# Altium project CHEM_CONTROL_BOX.PrjPcb (part 1 of 3)
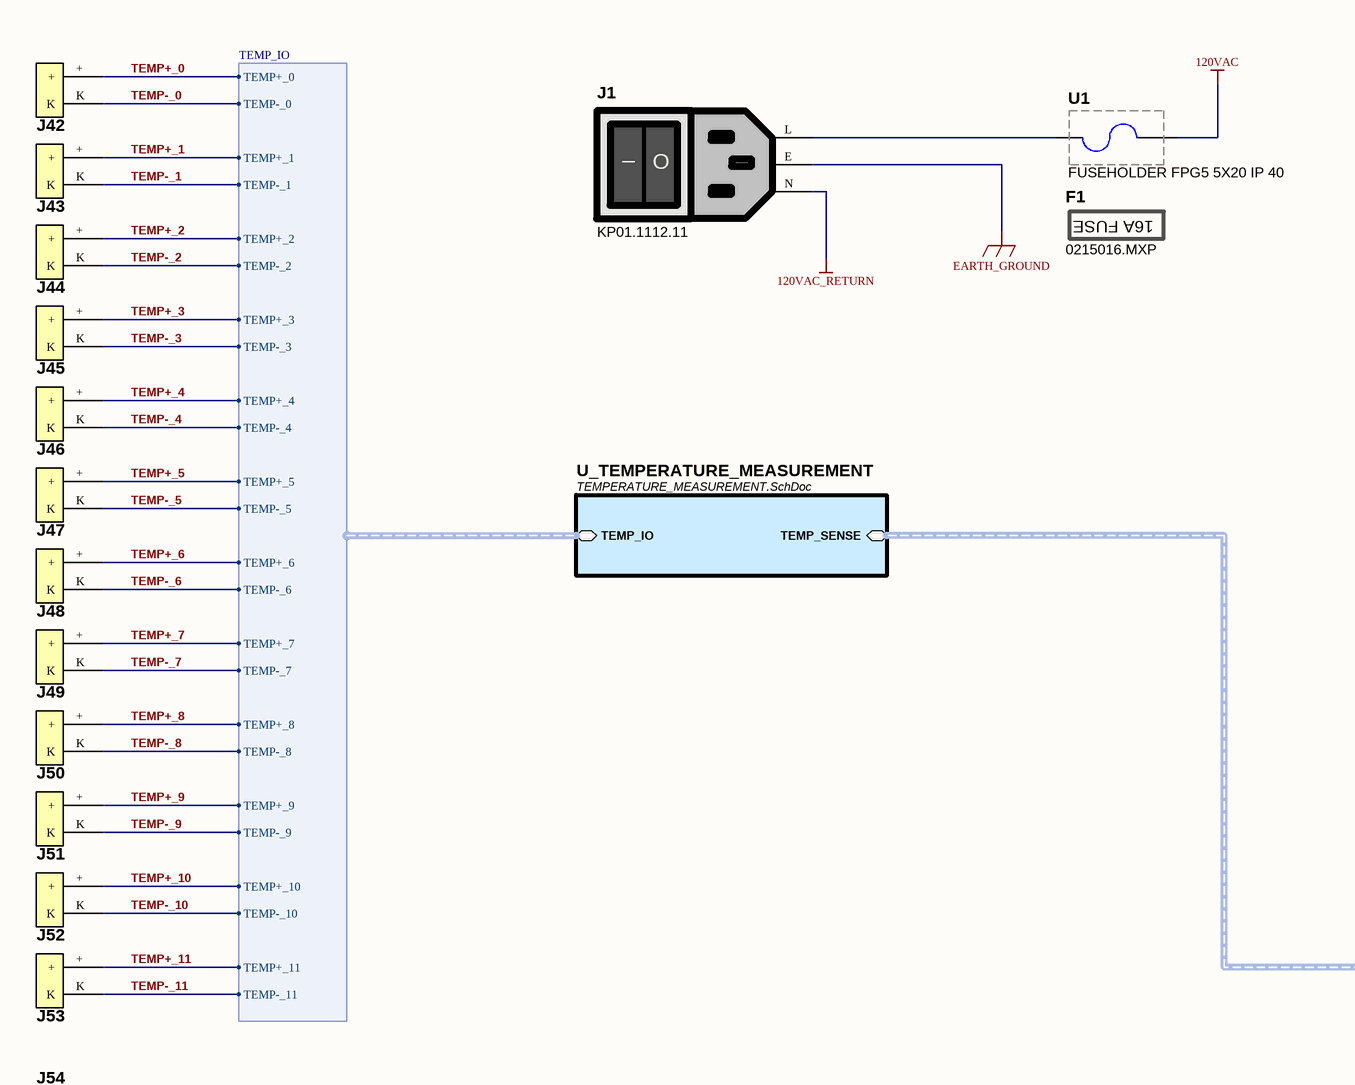
[diagram p0: CHEM_CONTROL_BOX.SchDoc, top left]
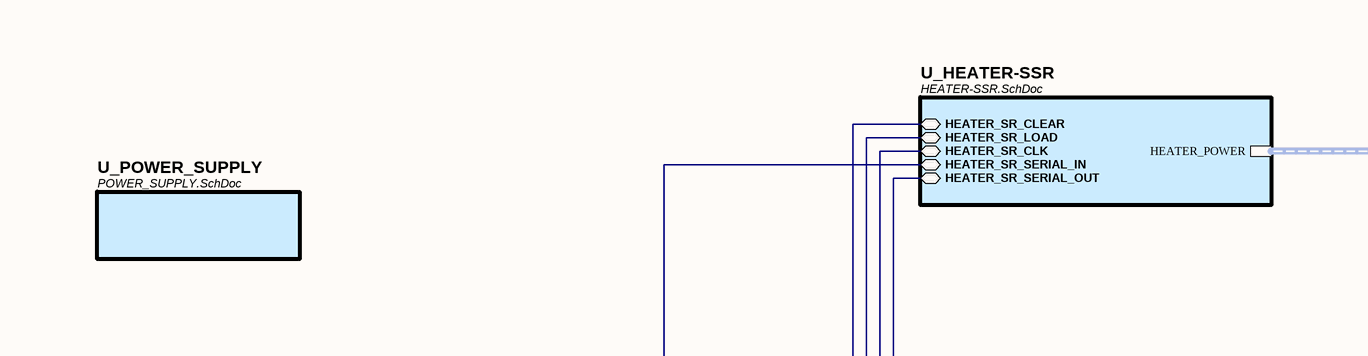
[diagram p1: CHEM_CONTROL_BOX.SchDoc, top middle]
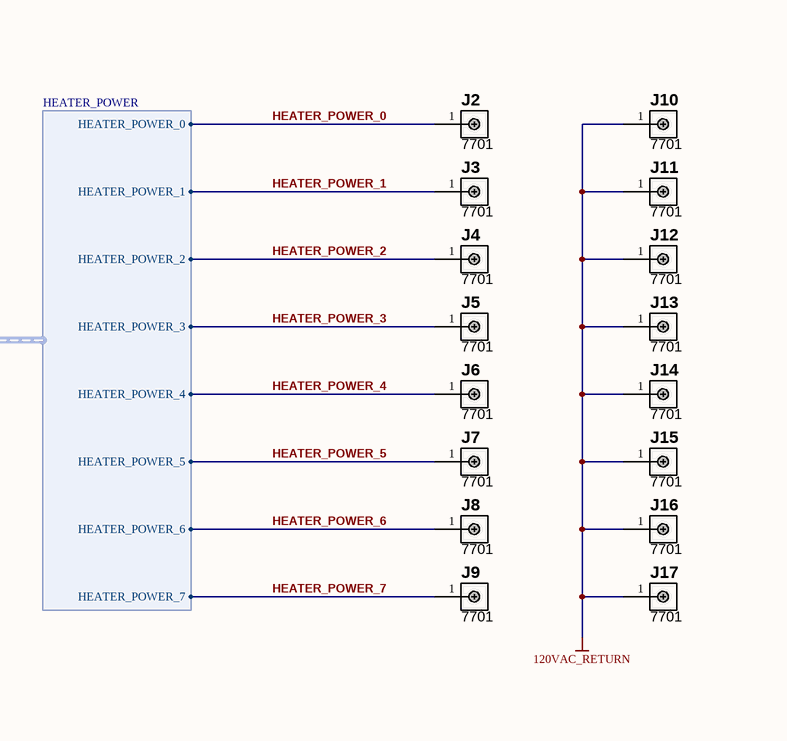
[diagram p2: CHEM_CONTROL_BOX.SchDoc, top right]
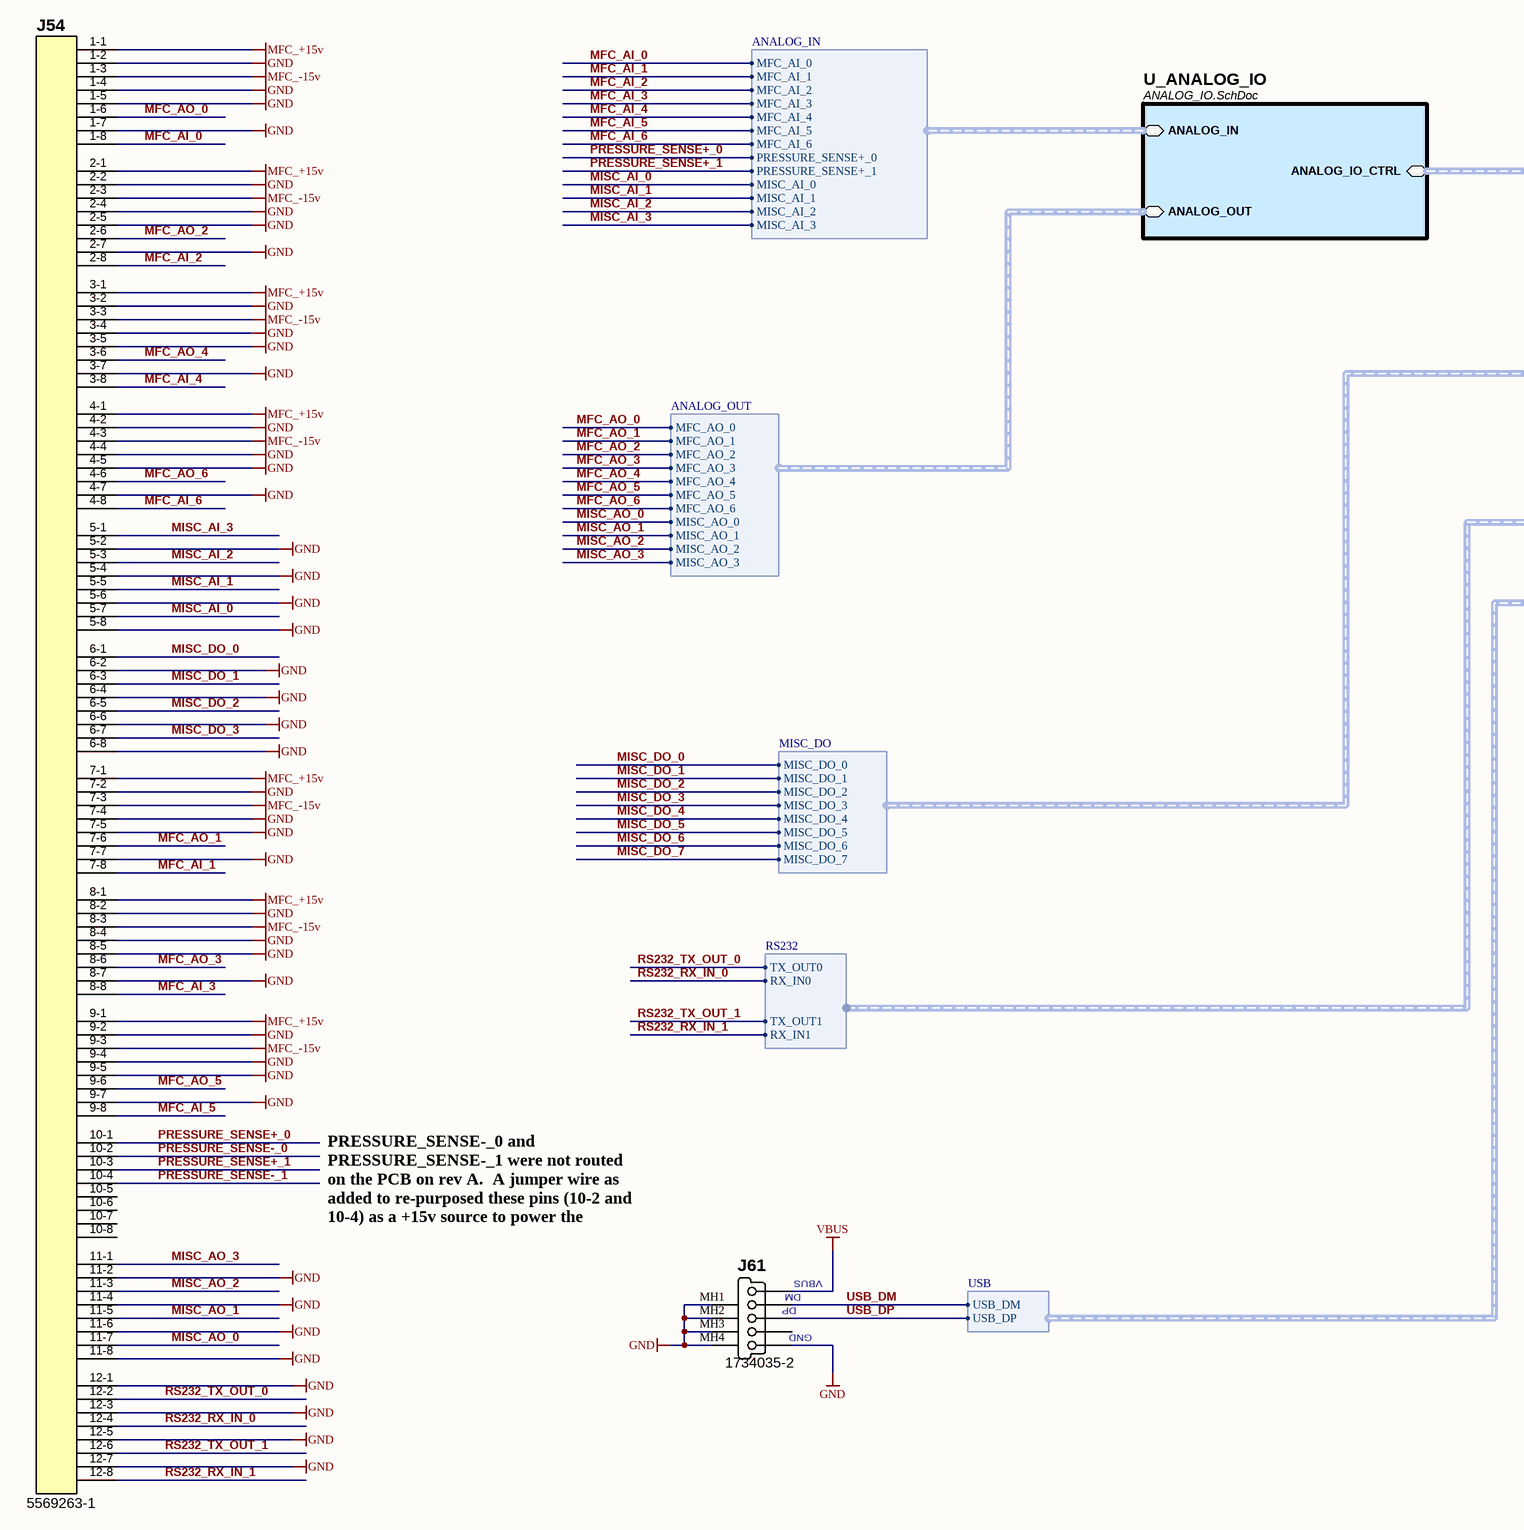
[diagram p3: CHEM_CONTROL_BOX.SchDoc, bottom left]
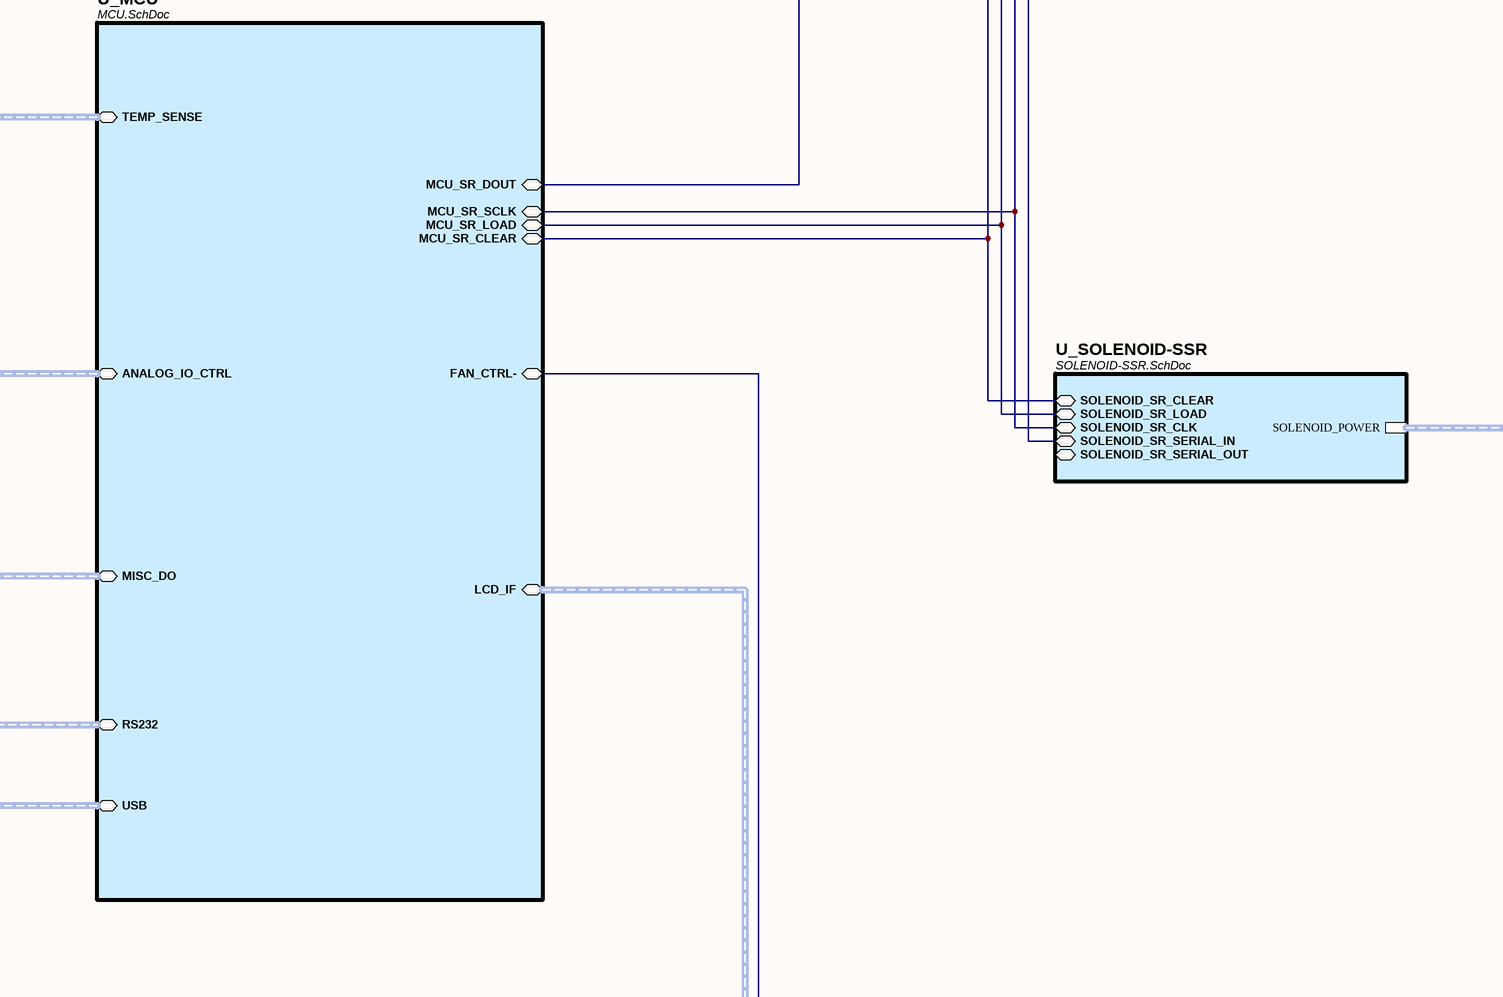
[diagram p4: CHEM_CONTROL_BOX.SchDoc, bottom middle]
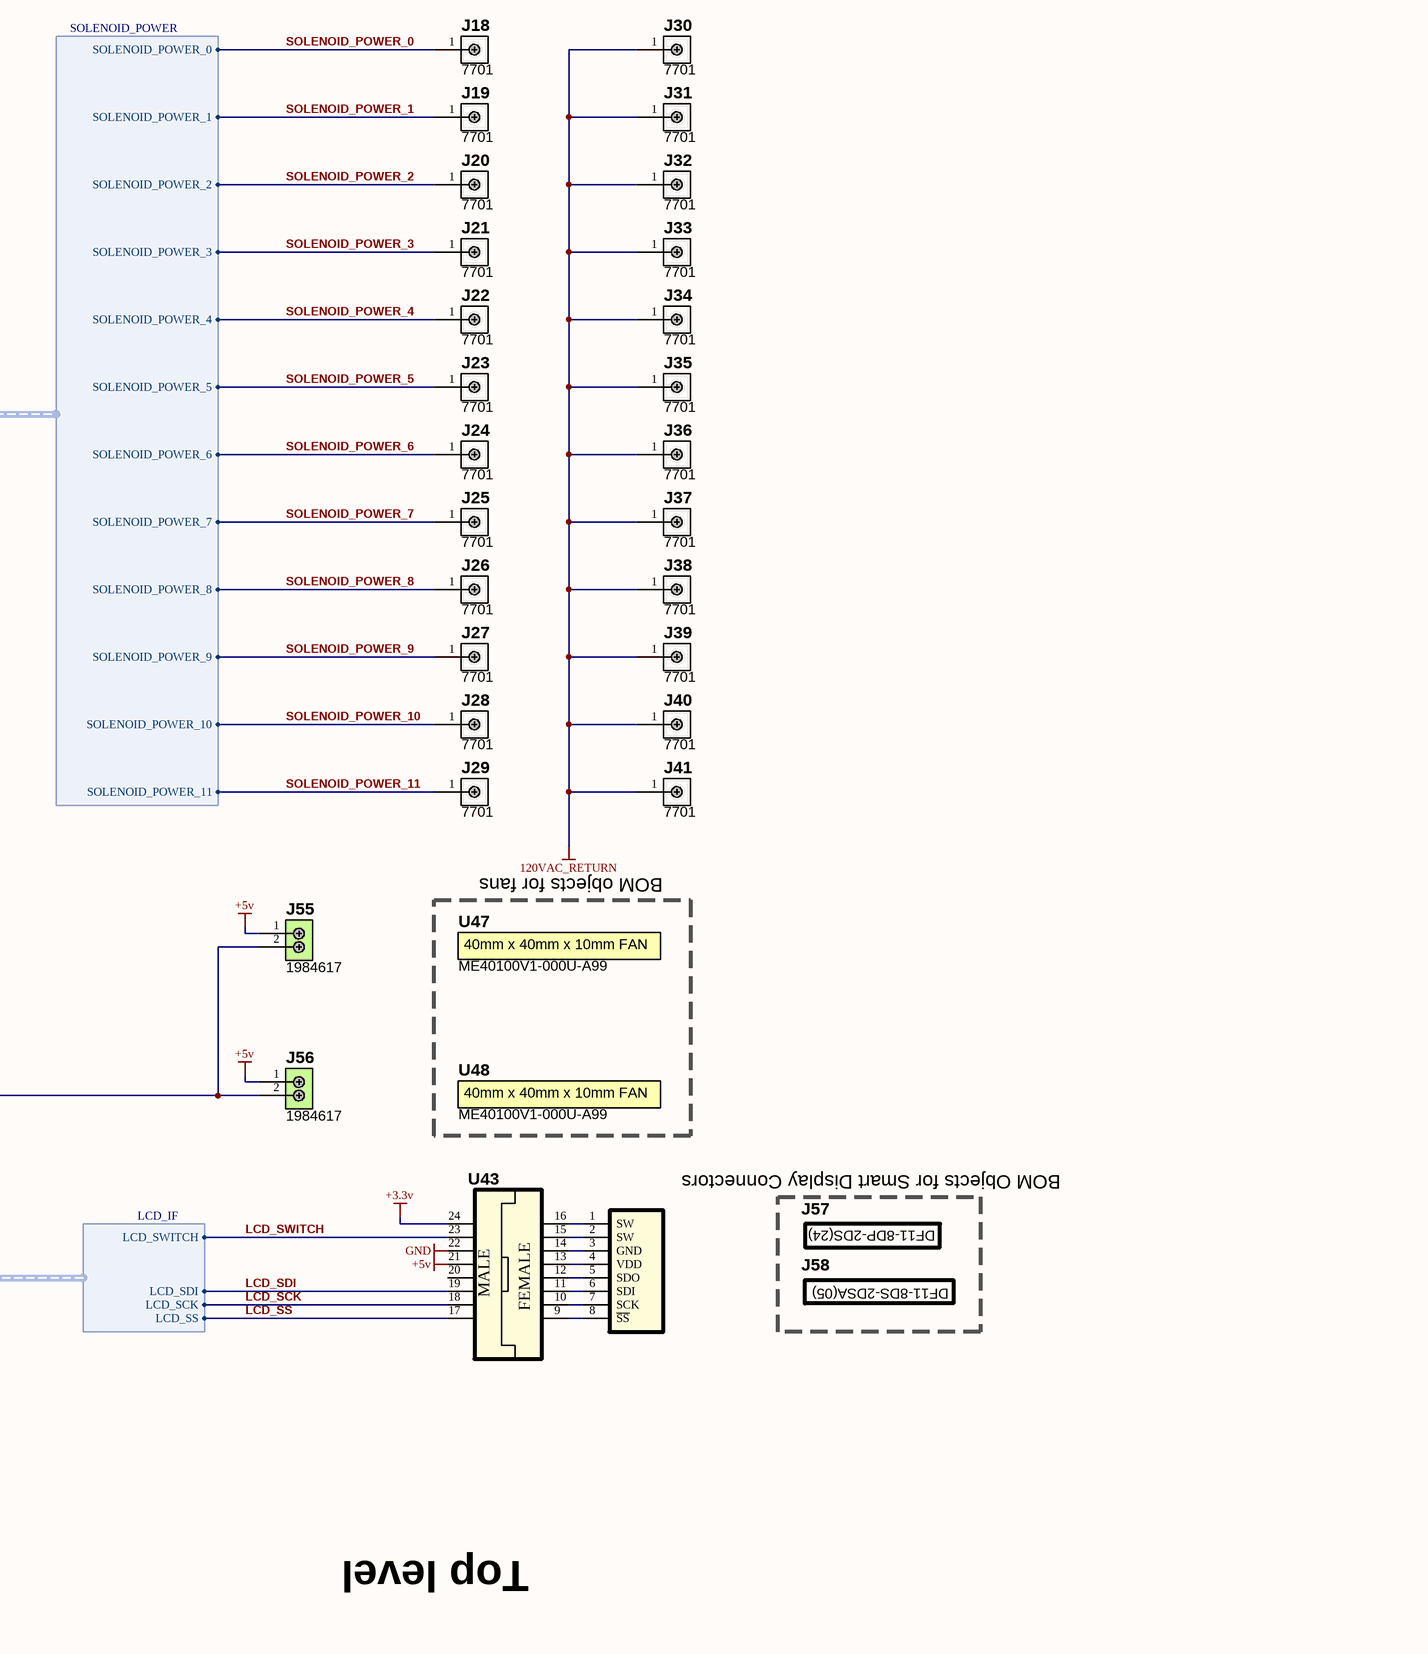
[diagram p5: CHEM_CONTROL_BOX.SchDoc, bottom right]
BOM_NOTES_LINE_1: -; BOM_NOTES_LINE_2: -; BOM_NOTES_LINE_3: -; BOM_NOTES_LINE_4: -; PCB_COPPER_WEIGHT_INNER: 2oz; PCB_COPPER_WEIGHT_OUTER: 20z; PCB_DIMENSION_X: -; PCB_DIMENSION_Y: -; PCB_DRC_DATE: 2013.09.23; PCB_FINISH_PLATING: LEAD FREE HASL; PCB_FINISHED_THICKNESS: .0625"; PCB_LAYERS: 2; PCB_MATERIAL: FR4; PCB_MIN_DRILL: 15mil; PCB_MIN_TRACE_SPACE: 8mil; PCB_MIN_TRACE_WIDTH: 8mil; PCB_PRINTOUT_SCALE: 1:1; PCB_SILKSCREEN_COLOR_BOTTOM: WHITE; PCB_SILKSCREEN_COLOR_TOP: WHITE; PCB_SOLDER_MASK_COLOR_BOTTOM: BLUE; PCB_SOLDER_MASK_COLOR_TOP: BLUE; PROJECT_ENGINEER: E.Hughes; PROJECT_PART_NUMBER_CCA: -; PROJECT_PART_NUMBER_PCB: -; PROJECT_PART_NUMBER_SCH: -; PROJECT_REVISION: a; PROJECT_SHORT_TITLE: CHEM_BOX; PROJECT_STATUS: PROTOTYPE; PROJECT_TITLE_LINE_1: Chem Control Box; SCH_DATE: 2013.9.8
7 sheets, 283 parts. Net scope: hierarchical (ports join the sheet entries above them; power ports are global).
Board file: CHEM_CONTROL_BOX.PcbDoc
Sheets:
  CHEM_CONTROL_BOX.SchDoc
    U_HEATER-SSR = HEATER-SSR.SchDoc
    U_SOLENOID-SSR = SOLENOID-SSR.SchDoc
    U_MCU = MCU.SchDoc
    U_POWER_SUPPLY = POWER_SUPPLY.SchDoc
    U_TEMPERATURE_MEASUREMENT = TEMPERATURE_MEASUREMENT.SchDoc
    U_ANALOG_IO = ANALOG_IO.SchDoc

## Sheet CHEM_CONTROL_BOX.SchDoc
size D; Organization: Altium Limited; Address1: 3 Minna Close; Address2: Belrose; Address3: NSW 2085; Address4: Australia; SheetNumber: 1; SheetTotal: 7

### Parts
F1  0215016.MXP  (mechanical)
J1  KP01.1112.11  [KP01.1112.11]
J2  7701  [7701]
J3  7701  [7701]
J4  7701  [7701]
J5  7701  [7701]
J6  7701  [7701]
J7  7701  [7701]
J8  7701  [7701]
J9  7701  [7701]
J10  7701  [7701]
J11  7701  [7701]
J12  7701  [7701]
J13  7701  [7701]
J14  7701  [7701]
J15  7701  [7701]
J16  7701  [7701]
J17  7701  [7701]
J18  7701  [7701]
J19  7701  [7701]
J20  7701  [7701]
J21  7701  [7701]
J22  7701  [7701]
J23  7701  [7701]
J24  7701  [7701]
J25  7701  [7701]
J26  7701  [7701]
J27  7701  [7701]
J28  7701  [7701]
J29  7701  [7701]
J30  7701  [7701]
J31  7701  [7701]
J32  7701  [7701]
J33  7701  [7701]
J34  7701  [7701]
J35  7701  [7701]
J36  7701  [7701]
J37  7701  [7701]
J38  7701  [7701]
J39  7701  [7701]
J40  7701  [7701]
J41  7701  [7701]
J42  PCC-SMP-K  [PCC-SMP-V]  (value not drawn)
J43  PCC-SMP-K  [PCC-SMP-V]  (value not drawn)
J44  PCC-SMP-K  [PCC-SMP-V]  (value not drawn)
J45  PCC-SMP-K  [PCC-SMP-V]  (value not drawn)
J46  PCC-SMP-K  [PCC-SMP-V]  (value not drawn)
J47  PCC-SMP-K  [PCC-SMP-V]  (value not drawn)
J48  PCC-SMP-K  [PCC-SMP-V]  (value not drawn)
J49  PCC-SMP-K  [PCC-SMP-V]  (value not drawn)
J50  PCC-SMP-K  [PCC-SMP-V]  (value not drawn)
J51  PCC-SMP-K  [PCC-SMP-V]  (value not drawn)
J52  PCC-SMP-K  [PCC-SMP-V]  (value not drawn)
J53  PCC-SMP-K  [PCC-SMP-V]  (value not drawn)
J54  5569263-1  [5569263-1]
J55  1984617  [1984617]
J56  1984617  [1984617]
J57  DF11-8DP-2DS(24)  (value not drawn)  (mechanical)
J58  DF11-8DS-2DSA(05)  (value not drawn)  (mechanical)
J61  1734035-2  [1734035-2]
U1  FUSEHOLDER FPG5 5X20 IP 40  [3101.0055]
U43  IS15DSBFP4RGB  [R/A IS15DSBFP4RGB]  (value not drawn)
U47  ME40100V1-000U-A99  [ME40100V1-000U-A99]
U48  ME40100V1-000U-A99  [ME40100V1-000U-A99]

### Sub-sheets
U_ANALOG_IO = ANALOG_IO.SchDoc: ANALOG_IN (harness ANALOG_IN), ANALOG_OUT (harness ANALOG_OUT), ANALOG_IO_CTRL (harness ANALOG_IO_CTRL)
U_HEATER-SSR = HEATER-SSR.SchDoc: HEATER_POWER (harness HEATER_POWER), HEATER_SR_CLEAR, HEATER_SR_LOAD, HEATER_SR_CLK, HEATER_SR_SERIAL_IN, HEATER_SR_SERIAL_OUT
U_MCU = MCU.SchDoc: ANALOG_IO_CTRL (harness ANALOG_IO_CTRL), TEMP_SENSE (harness TEMP_SENSE), LCD_IF (harness LCD_IF), FAN_CTRL-, MISC_DO (harness MISC_DO), RS232 (harness RS232), MCU_SR_DOUT, MCU_SR_SCLK, MCU_SR_LOAD, MCU_SR_CLEAR, USB (harness USB)
U_POWER_SUPPLY = POWER_SUPPLY.SchDoc: no entries
U_SOLENOID-SSR = SOLENOID-SSR.SchDoc: SOLENOID_POWER (harness SOLENOID_POWER), SOLENOID_SR_CLEAR, SOLENOID_SR_LOAD, SOLENOID_SR_CLK, SOLENOID_SR_SERIAL_IN, SOLENOID_SR_SERIAL_OUT
U_TEMPERATURE_MEASUREMENT = TEMPERATURE_MEASUREMENT.SchDoc: TEMP_IO (harness TEMP_IO), TEMP_SENSE (harness TEMP_SENSE)

### Harnesses
HEATER_POWER: HEATER_POWER_0, HEATER_POWER_1, HEATER_POWER_2, HEATER_POWER_3, HEATER_POWER_4, HEATER_POWER_5, HEATER_POWER_6, HEATER_POWER_7
SOLENOID_POWER: SOLENOID_POWER_0, SOLENOID_POWER_1, SOLENOID_POWER_2, SOLENOID_POWER_3, SOLENOID_POWER_4, SOLENOID_POWER_5, SOLENOID_POWER_6, SOLENOID_POWER_7, SOLENOID_POWER_8, SOLENOID_POWER_9, SOLENOID_POWER_10, SOLENOID_POWER_11
TEMP_IO: TEMP-_0, TEMP+_0, TEMP+_1, TEMP-_1, TEMP+_2, TEMP-_2, TEMP+_3, TEMP-_3, TEMP+_4, TEMP-_4, TEMP+_5, TEMP-_5, TEMP+_6, TEMP-_6, TEMP+_7, TEMP-_7, TEMP+_8, TEMP-_8, TEMP+_9, TEMP-_9, TEMP+_10, TEMP-_10, TEMP+_11, TEMP-_11
ANALOG_OUT: MFC_AO_0, MFC_AO_1, MFC_AO_2, MFC_AO_3, MFC_AO_4, MFC_AO_5, MFC_AO_6, MISC_AO_0, MISC_AO_1, MISC_AO_2, MISC_AO_3
ANALOG_IN: MFC_AI_0, MFC_AI_1, MFC_AI_2, MFC_AI_3, MFC_AI_4, MFC_AI_5, MFC_AI_6, PRESSURE_SENSE+_0, PRESSURE_SENSE+_1, MISC_AI_0, MISC_AI_1, MISC_AI_2, MISC_AI_3
LCD_IF: LCD_SWITCH, LCD_SDI, LCD_SCK, LCD_SS
MISC_DO: MISC_DO_0, MISC_DO_1, MISC_DO_2, MISC_DO_3, MISC_DO_4, MISC_DO_5, MISC_DO_6, MISC_DO_7
RS232: TX_OUT0, RX_IN0, TX_OUT1, RX_IN1
USB: USB_DM, USB_DP

### Nets
120VAC: U1.2
120VAC_RETURN: J1.N J10.1 J11.1 J12.1 J13.1 J14.1 J15.1 J16.1 J17.1 J30.1 J31.1 J32.1 J33.1 J34.1 J35.1 J36.1 J37.1 J38.1 J39.1 J40.1 J41.1
+3.3v: U43.24
+5v: J55.1 J56.1 U43.21
EARTH_GROUND: J1.E(G)
GND: J54.1-2 J54.1-4 J54.1-5 J54.1-7 J54.2-2 J54.2-4 J54.2-5 J54.2-7 J54.3-2 J54.3-4 J54.3-5 J54.3-7 J54.4-2 J54.4-4 J54.4-5 J54.4-7 J54.5-2 J54.5-4 J54.5-6 J54.5-8 J54.6-2 J54.6-4 J54.6-6 J54.6-8 J54.7-2 J54.7-4 J54.7-5 J54.7-7 J54.8-2 J54.8-4 J54.8-5 J54.8-7 J54.9-2 J54.9-4 J54.9-5 J54.9-7 J54.11-2 J54.11-4 J54.11-6 J54.11-8 J54.12-1 J54.12-3 J54.12-5 J54.12-7 J61.5(GND) J61.MH1(Tab) J61.MH2(Tab) J61.MH3(Tab) J61.MH4(Tab) U43.22
MFC_+15v: J54.1-1 J54.2-1 J54.3-1 J54.4-1 J54.7-1 J54.8-1 J54.9-1
MFC_-15v: J54.1-3 J54.2-3 J54.3-3 J54.4-3 J54.7-3 J54.8-3 J54.9-3
VBUS: J61.1(V_BUS_(5V))
HEATER_POWER_0: J2.1 ; sheet U_HEATER-SSR/HEATER_POWER.HEATER_POWER_0
HEATER_POWER_1: J3.1 ; sheet U_HEATER-SSR/HEATER_POWER.HEATER_POWER_1
HEATER_POWER_2: J4.1 ; sheet U_HEATER-SSR/HEATER_POWER.HEATER_POWER_2
HEATER_POWER_3: J5.1 ; sheet U_HEATER-SSR/HEATER_POWER.HEATER_POWER_3
HEATER_POWER_4: J6.1 ; sheet U_HEATER-SSR/HEATER_POWER.HEATER_POWER_4
HEATER_POWER_5: J7.1 ; sheet U_HEATER-SSR/HEATER_POWER.HEATER_POWER_5
HEATER_POWER_6: J8.1 ; sheet U_HEATER-SSR/HEATER_POWER.HEATER_POWER_6
HEATER_POWER_7: J9.1 ; sheet U_HEATER-SSR/HEATER_POWER.HEATER_POWER_7
LCD_SCK: U43.18 ; sheet U_HEATER-SSR/HEATER_SR_CLK, sheet U_SOLENOID-SSR/SOLENOID_SR_CLK, sheet U_MCU/MCU_SR_SCLK, sheet U_MCU/LCD_IF.LCD_SCK
LCD_SDI: U43.19 ; sheet U_MCU/LCD_IF.LCD_SDI
LCD_SS: U43.17 ; sheet U_MCU/LCD_IF.LCD_SS
LCD_SWITCH: U43.23 ; sheet U_MCU/LCD_IF.LCD_SWITCH
MCU_SR_CLEAR: sheet U_HEATER-SSR/HEATER_SR_CLEAR, sheet U_SOLENOID-SSR/SOLENOID_SR_CLEAR, sheet U_MCU/MCU_SR_CLEAR
MCU_SR_DOUT: sheet U_HEATER-SSR/HEATER_SR_SERIAL_IN, sheet U_MCU/MCU_SR_DOUT
MCU_SR_LOAD: sheet U_HEATER-SSR/HEATER_SR_LOAD, sheet U_SOLENOID-SSR/SOLENOID_SR_LOAD, sheet U_MCU/MCU_SR_LOAD
MFC_AI_0: J54.1-8 ; sheet U_ANALOG_IO/ANALOG_IN.MFC_AI_0
MFC_AI_1: J54.7-8 ; sheet U_ANALOG_IO/ANALOG_IN.MFC_AI_1
MFC_AI_2: J54.2-8 ; sheet U_ANALOG_IO/ANALOG_IN.MFC_AI_2
MFC_AI_3: J54.8-8 ; sheet U_ANALOG_IO/ANALOG_IN.MFC_AI_3
MFC_AI_4: J54.3-8 ; sheet U_ANALOG_IO/ANALOG_IN.MFC_AI_4
MFC_AI_5: J54.9-8 ; sheet U_ANALOG_IO/ANALOG_IN.MFC_AI_5
MFC_AI_6: J54.4-8 ; sheet U_ANALOG_IO/ANALOG_IN.MFC_AI_6
MFC_AO_0: J54.1-6 ; sheet U_ANALOG_IO/ANALOG_OUT.MFC_AO_0
MFC_AO_1: J54.7-6 ; sheet U_ANALOG_IO/ANALOG_OUT.MFC_AO_1
MFC_AO_2: J54.2-6 ; sheet U_ANALOG_IO/ANALOG_OUT.MFC_AO_2
MFC_AO_3: J54.8-6 ; sheet U_ANALOG_IO/ANALOG_OUT.MFC_AO_3
MFC_AO_4: J54.3-6 ; sheet U_ANALOG_IO/ANALOG_OUT.MFC_AO_4
MFC_AO_5: J54.9-6 ; sheet U_ANALOG_IO/ANALOG_OUT.MFC_AO_5
MFC_AO_6: J54.4-6 ; sheet U_ANALOG_IO/ANALOG_OUT.MFC_AO_6
MISC_AI_0: J54.5-7 ; sheet U_ANALOG_IO/ANALOG_IN.MISC_AI_0
MISC_AI_1: J54.5-5 ; sheet U_ANALOG_IO/ANALOG_IN.MISC_AI_1
MISC_AI_2: J54.5-3 ; sheet U_ANALOG_IO/ANALOG_IN.MISC_AI_2
MISC_AI_3: J54.5-1 ; sheet U_ANALOG_IO/ANALOG_IN.MISC_AI_3
MISC_AO_0: J54.11-7 ; sheet U_ANALOG_IO/ANALOG_OUT.MISC_AO_0
MISC_AO_1: J54.11-5 ; sheet U_ANALOG_IO/ANALOG_OUT.MISC_AO_1
MISC_AO_2: J54.11-3 ; sheet U_ANALOG_IO/ANALOG_OUT.MISC_AO_2
MISC_AO_3: J54.11-1 ; sheet U_ANALOG_IO/ANALOG_OUT.MISC_AO_3
MISC_DO_0: J54.6-1 ; sheet U_MCU/MISC_DO.MISC_DO_0
MISC_DO_1: J54.6-3 ; sheet U_MCU/MISC_DO.MISC_DO_1
MISC_DO_2: J54.6-5 ; sheet U_MCU/MISC_DO.MISC_DO_2
MISC_DO_3: J54.6-7 ; sheet U_MCU/MISC_DO.MISC_DO_3
PRESSURE_SENSE+_0: J54.10-1 ; sheet U_ANALOG_IO/ANALOG_IN.PRESSURE_SENSE+_0
PRESSURE_SENSE+_1: J54.10-3 ; sheet U_ANALOG_IO/ANALOG_IN.PRESSURE_SENSE+_1
PRESSURE_SENSE-_0: J54.10-2
PRESSURE_SENSE-_1: J54.10-4
RS232_RX_IN_0: J54.12-4 ; sheet U_MCU/RS232.RX_IN0
RS232_RX_IN_1: J54.12-8 ; sheet U_MCU/RS232.RX_IN1
RS232_TX_OUT_0: J54.12-2 ; sheet U_MCU/RS232.TX_OUT0
RS232_TX_OUT_1: J54.12-6 ; sheet U_MCU/RS232.TX_OUT1
SOLENOID_POWER_0: J18.1 ; sheet U_SOLENOID-SSR/SOLENOID_POWER.SOLENOID_POWER_0
SOLENOID_POWER_1: J19.1 ; sheet U_SOLENOID-SSR/SOLENOID_POWER.SOLENOID_POWER_1
SOLENOID_POWER_2: J20.1 ; sheet U_SOLENOID-SSR/SOLENOID_POWER.SOLENOID_POWER_2
SOLENOID_POWER_3: J21.1 ; sheet U_SOLENOID-SSR/SOLENOID_POWER.SOLENOID_POWER_3
SOLENOID_POWER_4: J22.1 ; sheet U_SOLENOID-SSR/SOLENOID_POWER.SOLENOID_POWER_4
SOLENOID_POWER_5: J23.1 ; sheet U_SOLENOID-SSR/SOLENOID_POWER.SOLENOID_POWER_5
SOLENOID_POWER_6: J24.1 ; sheet U_SOLENOID-SSR/SOLENOID_POWER.SOLENOID_POWER_6
SOLENOID_POWER_7: J25.1 ; sheet U_SOLENOID-SSR/SOLENOID_POWER.SOLENOID_POWER_7
SOLENOID_POWER_8: J26.1 ; sheet U_SOLENOID-SSR/SOLENOID_POWER.SOLENOID_POWER_8
SOLENOID_POWER_9: J27.1 ; sheet U_SOLENOID-SSR/SOLENOID_POWER.SOLENOID_POWER_9
SOLENOID_POWER_10: J28.1 ; sheet U_SOLENOID-SSR/SOLENOID_POWER.SOLENOID_POWER_10
SOLENOID_POWER_11: J29.1 ; sheet U_SOLENOID-SSR/SOLENOID_POWER.SOLENOID_POWER_11
TEMP+_0: J42.+ ; sheet U_TEMPERATURE_MEASUREMENT/TEMP_IO.TEMP+_0
TEMP+_1: J43.+ ; sheet U_TEMPERATURE_MEASUREMENT/TEMP_IO.TEMP+_1
TEMP+_2: J44.+ ; sheet U_TEMPERATURE_MEASUREMENT/TEMP_IO.TEMP+_2
TEMP+_3: J45.+ ; sheet U_TEMPERATURE_MEASUREMENT/TEMP_IO.TEMP+_3
TEMP+_4: J46.+ ; sheet U_TEMPERATURE_MEASUREMENT/TEMP_IO.TEMP+_4
TEMP+_5: J47.+ ; sheet U_TEMPERATURE_MEASUREMENT/TEMP_IO.TEMP+_5
TEMP+_6: J48.+ ; sheet U_TEMPERATURE_MEASUREMENT/TEMP_IO.TEMP+_6
TEMP+_7: J49.+ ; sheet U_TEMPERATURE_MEASUREMENT/TEMP_IO.TEMP+_7
TEMP+_8: J50.+ ; sheet U_TEMPERATURE_MEASUREMENT/TEMP_IO.TEMP+_8
TEMP+_9: J51.+ ; sheet U_TEMPERATURE_MEASUREMENT/TEMP_IO.TEMP+_9
TEMP+_10: J52.+ ; sheet U_TEMPERATURE_MEASUREMENT/TEMP_IO.TEMP+_10
TEMP+_11: J53.+ ; sheet U_TEMPERATURE_MEASUREMENT/TEMP_IO.TEMP+_11
TEMP-_0: J42.K ; sheet U_TEMPERATURE_MEASUREMENT/TEMP_IO.TEMP-_0
TEMP-_1: J43.K ; sheet U_TEMPERATURE_MEASUREMENT/TEMP_IO.TEMP-_1
TEMP-_2: J44.K ; sheet U_TEMPERATURE_MEASUREMENT/TEMP_IO.TEMP-_2
TEMP-_3: J45.K ; sheet U_TEMPERATURE_MEASUREMENT/TEMP_IO.TEMP-_3
TEMP-_4: J46.K ; sheet U_TEMPERATURE_MEASUREMENT/TEMP_IO.TEMP-_4
TEMP-_5: J47.K ; sheet U_TEMPERATURE_MEASUREMENT/TEMP_IO.TEMP-_5
TEMP-_6: J48.K ; sheet U_TEMPERATURE_MEASUREMENT/TEMP_IO.TEMP-_6
TEMP-_7: J49.K ; sheet U_TEMPERATURE_MEASUREMENT/TEMP_IO.TEMP-_7
TEMP-_8: J50.K ; sheet U_TEMPERATURE_MEASUREMENT/TEMP_IO.TEMP-_8
TEMP-_9: J51.K ; sheet U_TEMPERATURE_MEASUREMENT/TEMP_IO.TEMP-_9
TEMP-_10: J52.K ; sheet U_TEMPERATURE_MEASUREMENT/TEMP_IO.TEMP-_10
TEMP-_11: J53.K ; sheet U_TEMPERATURE_MEASUREMENT/TEMP_IO.TEMP-_11
USB_DM: J61.2(D-) ; sheet U_MCU/USB.USB_DM
USB_DP: J61.3(D+) ; sheet U_MCU/USB.USB_DP
NetC73_1: J55.2 J56.2 ; sheet U_MCU/FAN_CTRL-
NetJ1_L: J1.L U1.1
NetU37_14: sheet U_HEATER-SSR/HEATER_SR_SERIAL_OUT, sheet U_SOLENOID-SSR/SOLENOID_SR_SERIAL_IN
NetU43_1: U43.1(SW) U43.16
NetU43_2: U43.2(SW) U43.15
NetU43_3: U43.3(GND) U43.14
NetU43_4: U43.4(VDD) U43.13
NetU43_5: U43.5(SDO) U43.12
NetU43_6: U43.6(SDI) U43.11
NetU43_7: U43.7(SCK) U43.10
NetU43_8: U43.8(~{SS}) U43.9

Not connected (* = marked no-connect by the designer): J54 10-5 10-6 10-7 10-8; J61 4(NC); U43 20

### Buses and harness runs
harness sheet U_ANALOG_IO/ANALOG_IO_CTRL = sheet U_MCU/ANALOG_IO_CTRL
harness sheet U_MCU/TEMP_SENSE = sheet U_TEMPERATURE_MEASUREMENT/TEMP_SENSE

### Notes on the sheet
- BOM objects for fans
- BOM Objects for Smart Display Connectors
- PRESSURE_SENSE-_0 and PRESSURE_SENSE-_1 were not routed on the PCB on rev A.  A jumper wire as added to re-purposed these pins (10-2 and 10-4) as a +15v source to power the pressure sensor
- Top level
- -1
- Wavenumber LLC
- 2pl
- Rev:
- Sheet
- of
- (in symbol 0215016.MXP) 16A FUSE
- (in symbol 1734035-2) VBUS; DM; DP
- (in symbol KP01.1112.11) _; O
- (in symbol ME40100V1-000U-A99) 40mm x 40mm x 10mm FAN
- (in symbol R/A IS15DSBFP4RGB) MALE; FEMALE

### Library data of the parts
F1 = 0215016.MXP: FUSE 16A 250VAC 5X20 SLOW; Manufacturer: Littelfuse Inc; Fuse Type: Cartridge, Ceramic; Voltage Rating - AC: 250V; Breaking Capacity @ Rated Voltage: 500A; Melting I²t: 1408; Approvals: PSE, SEMKO, UL; DC Cold Resistance: 0.0031 Ohm; Value: 0215016.MXP; Supplier 1: Digi-Key; Supplier Part Number 1: F6044-ND; Manufacturer Part Number: 0215016.MXP; RoHS: RoHS Compliant; Category: Circuit Protection; Stock 1: 800; Pricing 1: 1=1.61, 10=1.456, 25=1.3796, 50=1.1754, 100=0.9965, 250=0.97092, 500=0.8176, 1000=0.72818, 2500=0.68985 (USD); Packaging: Bulk; Current Rating: 16A; Voltage Rating - DC: -; Response Time: Slow; Package / Case: 5mm x 20mm; Mounting Type: Holder; Operating Temperature: -55°C ~ 125°C; Color: -; Size / Dimension: 0.205" Dia x 0.787" L (5.20mm x 20.00mm); ComponentLink1URL: http://www.littelfuse.com/data/en/Data_Sheets/Littelfuse_Fuse_215_Series.pdf; ComponentLink1Description: http://www.littelfuse.com/data/en/Data_Sheets/Littelfuse_Fuse_215_Series.pdf
J1 = KP01.1112.11: AC Power Entry Modules SNAP-N PCB 2-POLE; Manufacturer: Schurter; Connector Type: IEC-320 C-14; Current Rating: 10 A; Filtered: No; Switch Function: Switched; Voltage Rating: 250 V; Value: KP01.1112.11; Supplier 1: Mouser; Supplier Part Number 1: 693-KP01.1112.11; Manufacturer Part Number: KP01.1112.11; RoHS: RoHS Compliant; Category: AC Power Entry Modules; Stock 1: 316; Pricing 1: 1=15.82, 25=14.04, 50=12.65, 100=11.93, 200=10.48 (AUD); Fused: No; Housing Material: Thermoplastic; Operating Temperature Range: - 25 C to + 70 C; Product: Inlets; Series: KP; Termination Style: Quick Connect; Flammability Rating: UL 94 V-0; Mounting Style: Snap In; Product Category: Power Entry Modules; Standard Pack Qty: 50; RoHS - Mouser: Y; Minimum Order Quantity: 1; Reeling: False; ComponentLink1URL: http://www.schurterinc.com/pdf/english/typ_kp__switch_.pdf; ComponentLink1Description: http://www.schurterinc.com/pdf/english/typ_kp__switch_.pdf
J2-J41 = 7701: TERM W/ASSEMBLD SCREW VERT PCMNT; Manufacturer: Keystone Electronics; Screw Size: 6-32; Current Rating: 15A; Number of Legs: 4; Screw Material: Brass; Screw Finish: Nickel; Supplier 1: Digi-Key; Supplier Part Number 1: 7701K-ND; Manufacturer Part Number: 7701; RoHS: RoHS Compliant; Category: Connectors, Interconnects; Stock 1: 77817; Pricing 1: 1=0.49, 10=0.462, 50=0.449, 100=0.354, 250=0.32324, 500=0.30784, 1000=0.256, 2500=0.23088, 5000=0.22318 (USD); Terminal Type: Screw Terminal, Power Tap; Termination: Solder; Mounting Type: Through Hole; Features: -; Contact Finish: Tin; Contact Material: Brass; Material - Insulation: -; ComponentLink1URL: http://www.keyelco.com/product-pdf.cfm?p=1081; ComponentLink1Description: http://www.keyelco.com/product-pdf.cfm?p=1081; Value: 7701
J42-J53 = PCC-SMP-K-100: Vertical K type thermocouple connector - K; Manufacturer: Omega; Manufacturer Part Number]: PCC-SMP-K-100; Supplier 1: Omega; Value: PCC-SMP-K; Supplier Part Number 1: PCC-SMP-K-100
J54 = 5569263-1: CONN MOD JACK R/A 8P8C SHIELDED; Manufacturer: TE Connectivity; Number of Positions/Contacts: 8p8c (RJ45, Ethernet); Number of Ports: 12; Shielding: Shielded, EMI Finger; Ratings: Cat5; LED Color: Does Not Contain LED; Tab Direction: Up and Down; Value: 5569263-1; Supplier 1: Digi-Key; Supplier Part Number 1: A31480-ND; Manufacturer Part Number: 5569263-1; RoHS: RoHS Compliant; Category: Connectors, Interconnects; Stock 1: 503; Pricing 1: 1=21.11, 10=19.055, 50=17.115, 100=16.5445, 250=15.63172, 500=15.1753, 1000=14.833 (USD); Packaging: Bulk; Connector Type: Jack; Number of Rows: 2; Mounting Type: Through Hole; Orientation: 90° Angle (Right); Termination: Solder; Features: Board Guide; Ingress Protection: -; Contact Material: Phosphor Bronze; Contact Finish: Gold; Contact Finish Thickness: 50µin (1.27µm); Housing Material: Polycyclohexylenedimethylene Terephthalate (PCT), Polyester; Operating Temperature: -40°C ~ 85°C; ComponentLink1URL: http://www.te.com/commerce/DocumentDelivery/DDEController?Action=srchrtrv&DocNm=5569263&DocType=Customer+Drawing&DocLang=English; ComponentLink1Description: http://www.te.com/commerce/DocumentDelivery/DDEController?Action=srchrtrv&DocNm=5569263&DocType=Customer+Drawing&DocLang=English
J55 J56 = 1984617: CONN TERM BLOCK T/H 2POS 3.5MM; Manufacturer: Phoenix Contact; Number of Levels: 1; Positions Per Level: 2; Pitch: 0.138" (3.50mm); Mating Orientation: Horizontal with Board; Current: 10A; Voltage: 300V; Wire Gauge: 16-26 AWG; Wire Termination: Screw - Rising Cage Clamp; Torque - Screw: 0.22-0.25 Nm (1.9-2.2 Lb-In); Screw Thread: M2; Supplier 1: Digi-Key; Supplier Part Number 1: 277-1721-ND; Manufacturer Part Number: 1984617; RoHS: RoHS Compliant; Category: Connectors, Interconnects; Stock 1: 10915; Pricing 1: 1=0.34, 10=0.322, 50=0.308, 100=0.2996, 250=0.28, 500=0.2576, 1000=0.238 (USD); Mounting Type: Through Hole; Features: Interlocking (Side); Color: Green; Packaging: Bulk; Operating Temperature: -; Housing Material: Polyamide (PA), Nylon; Contact Material - Plating: -; Clamp Material - Plating: -; Screw Material - Plating: -; ComponentLink1URL: http://media.digikey.com/pdf/Data%20Sheets/Phoenix%20Contact%20PDFs/1984617.pdf; ComponentLink1Description: http://media.digikey.com/pdf/Data%20Sheets/Phoenix%20Contact%20PDFs/1984617.pdf; Value: 1984617
J57 = DF11-8DP-2DS(24) (BOM ITEM): CONN HEADER 8POS 2MM RT ANG TIN; Manufacturer: Hirose Electric Co Ltd; Connector Type: Header, Shrouded; Number of Positions: 8; Number of Positions Loaded: All; Pitch: 0.079" (2.00mm); Supplier 1: Digi-Key; Manufacturer Part Number: DF11-8DP-2DS(24); RoHS: RoHS Compliant; Category: Connectors, Interconnects; Stock 1: 3605; Pricing 1: 1=0.87, 10=0.612, 50=0.472, 100=0.4108, 250=0.3496, 500=0.33212, 1000=0.29716, 2500=0.23598, 5000=0.23248 (USD); Packaging: Tube; Contact Type: Male Pin; Number of Rows: 2; Row Spacing: 0.079" (2.00mm); Contact Mating Length: 0.118" (3.00mm); Mounting Type: Through Hole, Right Angle; Termination: Solder; Fastening Type: Detent Lock; Features: -; Contact Finish: Tin; Contact Finish Thickness: -; Color: Black; ComponentLink1URL: http://www.hirose.co.jp/cataloge_hp/en_DF11_20130411.pdf; ComponentLink1Description: http://www.hirose.co.jp/cataloge_hp/en_DF11_20130411.pdf; Supplier Part Number 1: H10246-ND; Value: DF11-8DP-2DS(24)
J58 = DF11-8DS-2DSA(05) (BOM ITEM): CONN RECEPT 8POS 2MM PCB TIN; Manufacturer: Hirose Electric Co Ltd; Connector Type: Receptacle; Number of Positions: 8; Number of Positions Loaded: All; Pitch: 0.079" (2.00mm); Supplier 1: Digi-Key; Manufacturer Part Number: DF11-8DS-2DSA(05); RoHS: RoHS Compliant; Category: Connectors, Interconnects; Stock 1: 2569; Pricing 1: 1=1.14, 10=0.885, 25=0.8252, 50=0.75, 100=0.675, 250=0.57, 500=0.54, 1000=0.48, 2500=0.399 (USD); Packaging: Bulk; Contact Type: Female Socket; Number of Rows: 2; Row Spacing: 0.079" (2.00mm); Mounting Type: Through Hole; Termination: Press-Fit; Fastening Type: -; Features: -; Contact Finish: Tin; Contact Finish Thickness: -; Color: Black; ComponentLink1URL: http://www.hirose.co.jp/cataloge_hp/en_DF11_20130411.pdf; ComponentLink1Description: http://www.hirose.co.jp/cataloge_hp/en_DF11_20130411.pdf; Supplier Part Number 1: H10170-ND; Value: DF11-8DS-2DSA(05)
J61 = 1734035-2: Manufacturer: TE Connectivity; Connector Type: USB - mini B; Number of Contacts: 5; Gender: Receptacle; Specifications: USB 2.0; Supplier 1: Digi-Key; Supplier Part Number 1: A31727CT-ND; Manufacturer Part Number: 1734035-2; RoHS: RoHS Compliant; Category: Connectors, Interconnects; Stock 1: 133786; Pricing 1: 1=1.51, 10=1.325, 25=1.2476, 50=1.1956, 100=1.1435, 250=1.03956 (USD); Mounting Type: Surface Mount, Right Angle, Horizontal; Features: Board Guide; Packaging: Cut Tape (CT); Ingress Protection: -; ComponentLink1URL: http://documents.tycoelectronics.com/commerce/DocumentDelivery/DDEController?Action=srchrtrv&DocNm=1734035&DocType=CD&DocLang=EN; ComponentLink1Description: http://documents.tycoelectronics.com/commerce/DocumentDelivery/DDEController?Action=srchrtrv&DocNm=1734035&DocType=CD&DocLang=EN; Value: 1734035-2
U1 = 3101.0055: Manufacturer: Schurter Inc; Fuse Size: 5mm x 20mm; Number of Circuits: 1; Voltage: 250V; Current Rating: 16A; Value: FUSEHOLDER FPG5 5X20 IP 40; Supplier 1: Digi-Key; Supplier Part Number 1: 486-2056-ND; Manufacturer Part Number: 3101.0055; RoHS: RoHS Compliant; Category: Circuit Protection; Stock 1: 125; Pricing 1: 1=3.07, 25=2.454, 50=2.2086, 100=2.0859, 250=1.84052, 500=1.63192 (USD); Type: Holder; Mounting Type: PCB, Horizontal; Termination Style: PC Pin; Material: Copper Alloy, Tin Plated; ComponentLink1URL: http://www.schurterinc.com/var/schurter/storage/ilcatalogue/files/document/datasheet/en/pdf/typ_FPG5.pdf; ComponentLink1Description: http://www.schurterinc.com/var/schurter/storage/ilcatalogue/files/document/datasheet/en/pdf/typ_FPG5.pdf
U43 = R/A IS15DSBFP4RGB: 64x32 Compact Smart Switch; Manufacturer: NKK Switches; Male Connetor: DF11-8DP-2DS(24); Supplier 1: Mouser; Supplier Part Number 1: 633-IS15DSBFP4RGB; Value: IS15DSBFP4RGB; Manufacturer Part Number: IS15DSBFP4RGB
U47 U48 = ME40100V1-000U-A99: FAN 40X10MM 5VDC 1.08W 8CFM; Manufacturer: Sunon Fans; Air Flow: 8.0 CFM (0.226m&sup3;/min); Static Pressure: 0.190 in H2O (47.3 Pa); Bearing Type: Vapo-Bearing™; Fan Type: Tubeaxial; Noise: 32 dB(A); RPM: 7000 RPM; Current Rating: 0.215A; Material - Frame: Polybutylene Terephthalate (PBT); Value: ME40100V1-000U-A99; Supplier 1: Digi-Key; Supplier Part Number 1: 259-1575-ND; Manufacturer Part Number: ME40100V1-000U-A99; RoHS: RoHS Compliant; Category: Fans, Thermal Management; Stock 1: 4525; Pricing 1: 1=4.75, 10=4.356, 25=3.96, 50=3.564, 100=3.267, 250=3.11852, 500=2.9205, 1000=2.7225 (USD); Voltage - Rated: 5VDC; Features: -; Power (Watts): 1.08W; Size / Dimension: Square - 40mm L x 40mm H x 10mm W; Termination: 2 Wire Leads; Weight: 0.03 lb (13.61g); Operating Temperature: -; Voltage Range: -; Life Expectancy: -; Material - Blade: Polybutylene Terephthalate (PBT); ComponentLink1URL: http://www.sunon.com/uFiles/file/03_products/08-catalog%20download/Sunon%20DC%20Brushless%20Fan%20&%20Blower_(190-E).pdf; ComponentLink1Description: http://www.sunon.com/uFiles/file/03_products/08-catalog%20download/Sunon%20DC%20Brushless%20Fan%20&%20Blower_(190-E).pdf

## Sheet HEATER-SSR.SchDoc
size D; SheetNumber: 5; SheetTotal: 7
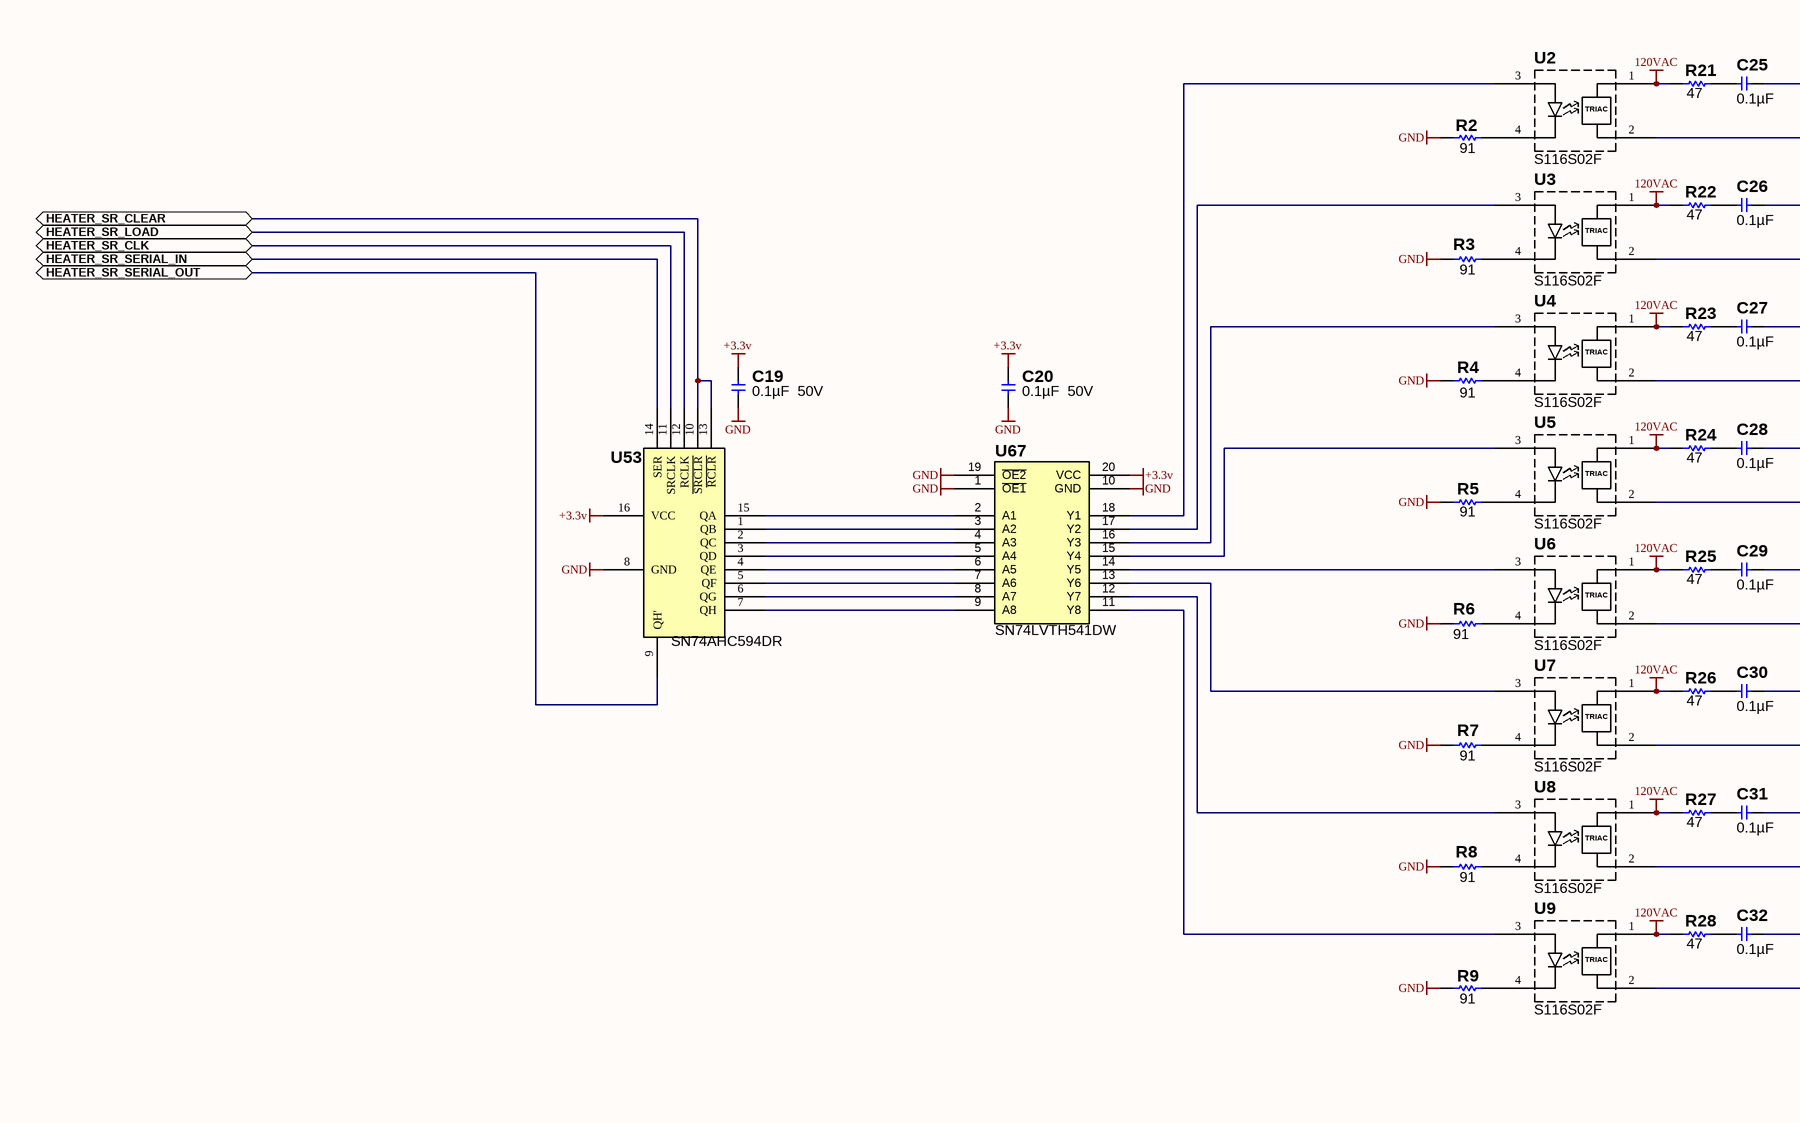
[diagram p6: HEATER-SSR.SchDoc, left]
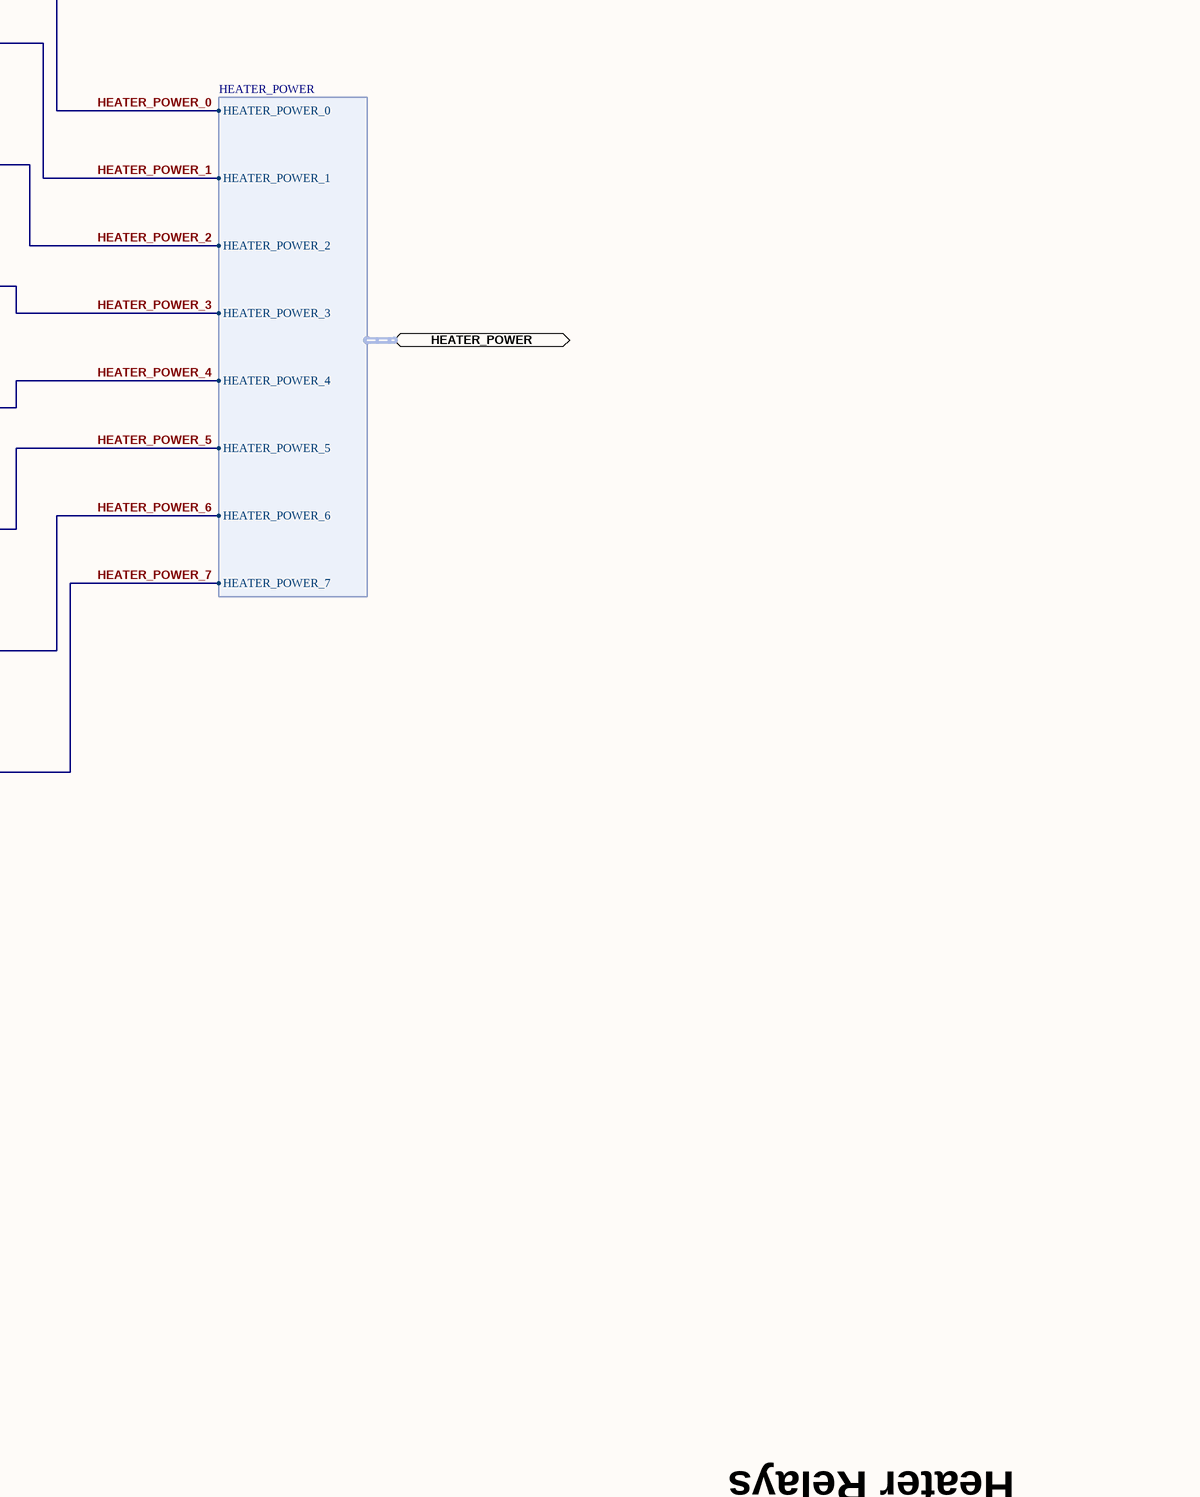
[diagram p7: HEATER-SSR.SchDoc, right]

### Parts
C19  0.1µF  50V  [C0805_LD]
C20  0.1µF  50V  [C0805_LD]
C25  0.1µF  [C1206_LD]
C26  0.1µF  [C1206_LD]
C27  0.1µF  [C1206_LD]
C28  0.1µF  [C1206_LD]
C29  0.1µF  [C1206_LD]
C30  0.1µF  [C1206_LD]
C31  0.1µF  [C1206_LD]
C32  0.1µF  [C1206_LD]
R2  91  [R0805_LD]
R3  91  [R0805_LD]
R4  91  [R0805_LD]
R5  91  [R0805_LD]
R6  91  [R0805_LD]
R7  91  [R0805_LD]
R8  91  [R0805_LD]
R9  91  [R0805_LD]
R21  47  [R1206_LD]
R22  47  [R1206_LD]
R23  47  [R1206_LD]
R24  47  [R1206_LD]
R25  47  [R1206_LD]
R26  47  [R1206_LD]
R27  47  [R1206_LD]
R28  47  [R1206_LD]
U2  S116S02F  [SHARP SIP-4 SSR]
U3  S116S02F  [SHARP SIP-4 SSR]
U4  S116S02F  [SHARP SIP-4 SSR]
U5  S116S02F  [SHARP SIP-4 SSR]
U6  S116S02F  [SHARP SIP-4 SSR]
U7  S116S02F  [SHARP SIP-4 SSR]
U8  S116S02F  [SHARP SIP-4 SSR]
U9  S116S02F  [SHARP SIP-4 SSR]
U53  SN74AHC594DR  [SOIC127P600X145-16L]
U67  SN74LVTH541DW  [SOIC127P1030X265-20L]

### Ports
HEATER_POWER (harness HEATER_POWER), HEATER_SR_CLEAR, HEATER_SR_CLK, HEATER_SR_LOAD, HEATER_SR_SERIAL_IN, HEATER_SR_SERIAL_OUT

### Harnesses
HEATER_POWER: HEATER_POWER_0, HEATER_POWER_1, HEATER_POWER_2, HEATER_POWER_3, HEATER_POWER_4, HEATER_POWER_5, HEATER_POWER_6, HEATER_POWER_7

### Nets
120VAC: R21.1 R22.1 R23.1 R24.1 R25.1 R26.1 R27.1 R28.1 U2.1 U3.1 U4.1 U5.1 U6.1 U7.1 U8.1 U9.1
+3.3v: C19.2 C20.2 U53.16(VCC) U67.20(VCC)
GND: C19.1 C20.1 R2.1 R3.1 R4.1 R5.1 R6.1 R7.1 R8.1 R9.1 U53.8(GND) U67.1(~{OE1}) U67.10(GND) U67.19(~{OE2})
HEATER_POWER_0: C25.2 U2.2 ; port HEATER_POWER.HEATER_POWER_0
HEATER_POWER_1: C26.2 U3.2 ; port HEATER_POWER.HEATER_POWER_1
HEATER_POWER_2: C27.2 U4.2 ; port HEATER_POWER.HEATER_POWER_2
HEATER_POWER_3: C28.2 U5.2 ; port HEATER_POWER.HEATER_POWER_3
HEATER_POWER_4: C29.2 U6.2 ; port HEATER_POWER.HEATER_POWER_4
HEATER_POWER_5: C30.2 U7.2 ; port HEATER_POWER.HEATER_POWER_5
HEATER_POWER_6: C31.2 U8.2 ; port HEATER_POWER.HEATER_POWER_6
HEATER_POWER_7: C32.2 U9.2 ; port HEATER_POWER.HEATER_POWER_7
LCD_SCK: U53.11(SRCLK) ; port HEATER_SR_CLK
MCU_SR_CLEAR: U53.10(~{SRCLR}) U53.13(~{RCLR}) ; port HEATER_SR_CLEAR
MCU_SR_DOUT: U53.14(SER) ; port HEATER_SR_SERIAL_IN
MCU_SR_LOAD: U53.12(RCLK) ; port HEATER_SR_LOAD
NetC25_1: C25.1 R21.2
NetC26_1: C26.1 R22.2
NetC27_1: C27.1 R23.2
NetC28_1: C28.1 R24.2
NetC29_1: C29.1 R25.2
NetC30_1: C30.1 R26.2
NetC31_1: C31.1 R27.2
NetC32_1: C32.1 R28.2
NetR2_2: R2.2 U2.4
NetR3_2: R3.2 U3.4
NetR4_2: R4.2 U4.4
NetR5_2: R5.2 U5.4
NetR6_2: R6.2 U6.4
NetR7_2: R7.2 U7.4
NetR8_2: R8.2 U8.4
NetR9_2: R9.2 U9.4
NetU2_3: U2.3 U67.18(Y1)
NetU3_3: U3.3 U67.17(Y2)
NetU4_3: U4.3 U67.16(Y3)
NetU5_3: U5.3 U67.15(Y4)
NetU6_3: U6.3 U67.14(Y5)
NetU7_3: U7.3 U67.13(Y6)
NetU8_3: U8.3 U67.12(Y7)
NetU9_3: U9.3 U67.11(Y8)
NetU37_14: U53.9(QH') ; port HEATER_SR_SERIAL_OUT
NetU53_1: U53.1(QB) U67.3(A2)
NetU53_2: U53.2(QC) U67.4(A3)
NetU53_3: U53.3(QD) U67.5(A4)
NetU53_4: U53.4(QE) U67.6(A5)
NetU53_5: U53.5(QF) U67.7(A6)
NetU53_6: U53.6(QG) U67.8(A7)
NetU53_7: U53.7(QH) U67.9(A8)
NetU53_15: U53.15(QA) U67.2(A1)

### Notes on the sheet
- Heater Relays
- -1
- Wavenumber LLC
- 2pl
- Rev:
- Sheet
- of
- (in symbol S116S02F) TRIAC

### Library data of the parts
C19 C20 = GRM21BR71H104KA01L: CAP CER 0.1UF 50V 10% X7R 0805; Manufacturer: Murata Electronics North America; Value: 0.1µF  50V; Temperature Coefficient: X7R; Manufacturer Part Number: GRM21BR71H104KA01L; ComponentLink1Description: \\altium.sil.arl.psu.edu\Libraries\datasheets\Murata Electronics North America\c02e.pdf; ComponentLink1URL: http://search.murata.co.jp/Ceramy/image/img/A01X/G101/ENG/GRM1555C1HR60WA01-01.pdf; ComponentLink2Description: External Datasheet; ComponentLink2URL: http://www.murata.com/products/catalog/pdf/c02e.pdf; Stocked: 0; Supplier 1: Digi-Key; Supplier Part Number 1: 490-1666-1-ND; Category: Capacitors; Sort Value: 100000; Sort Value Package: 0805_100000; Pricing: 1 = 0.1  ;  10 = 0.046  ;  50 = 0.0248  ;  100 = 0.0209  ;  250 = 0.01712  ;  500 = 0.01464  ;  1000 = 0.0114 (USD); Sales Status: Active; Capacitance: 0.1µF; Voltage - Rated: 50V; Tolerance: ±10%; Mounting Type: Surface Mount- MLCC; Operating Temperature: -55°C ~ 125°C; Applications: General Purpose; Ratings: -; Package / Case: 0805 (2012 Metric); Size / Dimension: 0.079" L x 0.049" W (2.00mm x 1.25mm); Height - Seated (Max): -; Thickness (Max): 0.053" (1.35mm); Lead Spacing: -; Features: -; Packaging: Cut Tape (CT); Lead Style: -; Package: 0805; Thickness: 135
C25-C32 = GRM31CR72E104KW03L: CAP CER 0.1UF 250V 10% X7R 1206; Manufacturer: Murata Electronics North America; Value: 0.1µF; Temperature Coefficient: X7R; Manufacturer Part Number: GRM31CR72E104KW03L; ComponentLink1Description: \\altium.sil.arl.psu.edu\Libraries\datasheets\Murata Electronics North America\c02e.pdf; ComponentLink1URL: http://search.murata.co.jp/Ceramy/image/img/A01X/G101/ENG/GRM1555C1HR60WA01-01.pdf; ComponentLink2Description: External Datasheet; ComponentLink2URL: http://www.murata.com/products/catalog/pdf/c02e.pdf; Stocked: 0; Supplier 1: Digi-Key; Supplier Part Number 1: 490-3542-1-ND; Category: Capacitors; Sort Value: 100000; Sort Value Package: 1206_100000; Pricing: 1 = 0.37  ;  10 = 0.308  ;  50 = 0.1732  ;  100 = 0.154  ;  250 = 0.11552  ;  500 = 0.10202  ;  1000 = 0.09048 (USD); Sales Status: Active; Capacitance: 0.1µF; Voltage - Rated: 250V; Tolerance: ±10%; Mounting Type: Surface Mount- MLCC; Operating Temperature: -55°C ~ 125°C; Applications: General Purpose; Ratings: -; Package / Case: 1206 (3216 Metric); Size / Dimension: 0.126" L x 0.063" W (3.20mm x 1.60mm); Height - Seated (Max): -; Thickness (Max): 0.071" (1.80mm); Lead Spacing: -; Features: -; Packaging: Cut Tape (CT); Lead Style: -; Package: 1206; Thickness: 180
R2-R9 = ERJ-6ENF91R0V: RES 91 OHM 1/8W 1% 0805 SMD; Manufacturer: Panasonic Electronic Components; Package Power: 0805  (0.125W); Power (Watts): 0.125W- 1/8W; Temperature Coefficient: ±100ppm/°C; Limiting Element Voltage: 150; Maximum Overload Voltage: 200; Maximum Working Voltage: 3.4V; Value: 91; Manufacturer Part Number: ERJ-6ENF91R0V; ComponentLink1Description: Internal Datasheet; ComponentLink1URL: \\altium.sil.arl.psu.edu\Libraries\datasheets\Panasonic Electronic Components\AOA0000CE2.pdf; ComponentLink2Description: External Datasheet; ComponentLink2URL: http://industrial.panasonic.com/www-data/pdf/AOA0000/AOA0000CE2.pdf; Stocked: 0; Supplier 1: Digi-Key; Supplier Part Number 1: P91.0CCT-ND; Category: Resistors; Resistance (Ohms): 91; Composition: Thick Film; Features: -; Tolerance: ±1%; Package / Case: 0805 (2012 Metric); Footprint: 805; Size / Dimension: 0.079" L x 0.049" W (2.00mm x 1.25mm); Height: 0.028" (0.70mm); Number of Terminations: 2; Packaging: Cut Tape (CT); Sort Value: 91; Sort Value Package: 805_91
R21-R28 = ERJ-8ENF47R0V: RES 47 OHM 1/4W 1% 1206 SMD; Manufacturer: Panasonic Electronic Components; Package Power: 1206  (0.25W); Power (Watts): 0.25W- 1/4W; Temperature Coefficient: ±100ppm/°C; Limiting Element Voltage: 200; Maximum Overload Voltage: 400; Maximum Working Voltage: 3.4V; Value: 47; Manufacturer Part Number: ERJ-8ENF47R0V; ComponentLink1Description: Internal Datasheet; ComponentLink1URL: \\altium.sil.arl.psu.edu\Libraries\datasheets\Panasonic Electronic Components\AOA0000CE2.pdf; ComponentLink2Description: External Datasheet; ComponentLink2URL: http://industrial.panasonic.com/www-data/pdf/AOA0000/AOA0000CE2.pdf; Stocked: 0; Supplier 1: Digi-Key; Supplier Part Number 1: P47.0FCT-ND; Category: Resistors; Resistance (Ohms): 47; Composition: Thick Film; Features: -; Tolerance: ±1%; Package / Case: 1206 (3216 Metric); Footprint: 1206; Size / Dimension: 0.126" L x 0.063" W (3.20mm x 1.60mm); Height: 0.028" (0.70mm); Number of Terminations: 2; Packaging: Cut Tape (CT); Sort Value: 47; Sort Value Package: 1206_47
U2-U9 = S116S02F: Solid State Relays - PCB Mount 16A Zero Cross Type Triac output SSR; Manufacturer: Sharp Microelectronics; Load Voltage Rating: 400 V; Supplier 1: Mouser; Manufacturer Part Number: S116S02F; RoHS: RoHS Compliant; Category: Solid State Relays - PCB Mount; Stock 1: 60; Pricing 1: 1=8.07, 10=6.66, 50=6.05, 100=5.85, 250=5.52, 500=5.24, 1000=5.04, 2500=4.83 (AUD); Package / Case: SIP-4; Series: S; Termination Style: Lead Termination; Mounting Style: Through Hole; Product Category: Solid State Relays; Product Type: PCB Mount; Standard Pack Qty: 200; RoHS - Mouser: Y; Minimum Order Quantity: 1; Reeling: False; ComponentLink1URL: http://www.mouser.com/ds/2/365/s216s02_e-184067.pdf; ComponentLink1Description: http://www.mouser.com/ds/2/365/s216s02_e-184067.pdf; Supplier Part Number 1: 852-S116S02F; Value: S116S02F
U53 = SN74AHC594DR: IC SHIFT REGISTER 8BIT 16-SOIC; Manufacturer: Texas Instruments; Output Type: Standard; Number of Elements: 1; Number of Bits per Element: 8; Function: Serial to Parallel; Voltage - Supply: 2 V ~ 5.5 V; Supplier 1: Digi-Key; Manufacturer Part Number: SN74AHC594DR; RoHS: RoHS Compliant; Category: Integrated Circuits (ICs); Stock 1: 1808; Pricing 1: 1=0.59, 10=0.494, 25=0.4332, 100=0.3708, 250=0.3216, 500=0.2724, 1000=0.21 (USD); Packaging: Cut Tape (CT); Logic Type: Shift Register; Operating Temperature: -40°C ~ 85°C; Mounting Type: Surface Mount; Package / Case: 16-SOIC (0.154", 3.90mm Width); Supplier Device Package: 16-SOIC N; ComponentLink1URL: http://www.ti.com/lit/ds/symlink/sn74ahc594.pdf; ComponentLink1Description: http://www.ti.com/lit/ds/symlink/sn74ahc594.pdf; Supplier Part Number 1: 296-31743-1-ND; Value: SN74AHC594DR
U67 = SN74LVTH541DW: IC BUFF/DVR TRI-ST 8BIT 20SOIC; Manufacturer: Texas Instruments; Logic Type: Buffer/Line Driver, Non-Inverting; Number of Elements: 1; Number of Bits per Element: 8; Current - Output High, Low: 32mA, 64mA; Voltage - Supply: 2.7 V ~ 3.6 V; Value: SN74LVTH541DW; Supplier 1: Digi-Key; Supplier Part Number 1: 296-8728-5-ND; Manufacturer Part Number: SN74LVTH541DW; RoHS: RoHS Compliant; Category: Integrated Circuits (ICs); Stock 1: 8053; Pricing 1: 1=2.02, 25=1.6252, 100=1.4625, 250=1.3, 500=1.1375, 1000=0.9425, 2500=0.8775, 5000=0.845, 10000=0.8125 (USD); Packaging: Tube; Operating Temperature: -40°C ~ 85°C; Mounting Type: Surface Mount; Package / Case: 20-SOIC (0.295", 7.50mm Width); Supplier Device Package: 20-SOIC; ComponentLink1URL: http://www.ti.com/lit/ds/symlink/sn74lvth541.pdf; ComponentLink1Description: http://www.ti.com/lit/ds/symlink/sn74lvth541.pdf

## Sheet SOLENOID-SSR.SchDoc
size D; SheetNumber: 4; SheetTotal: 7
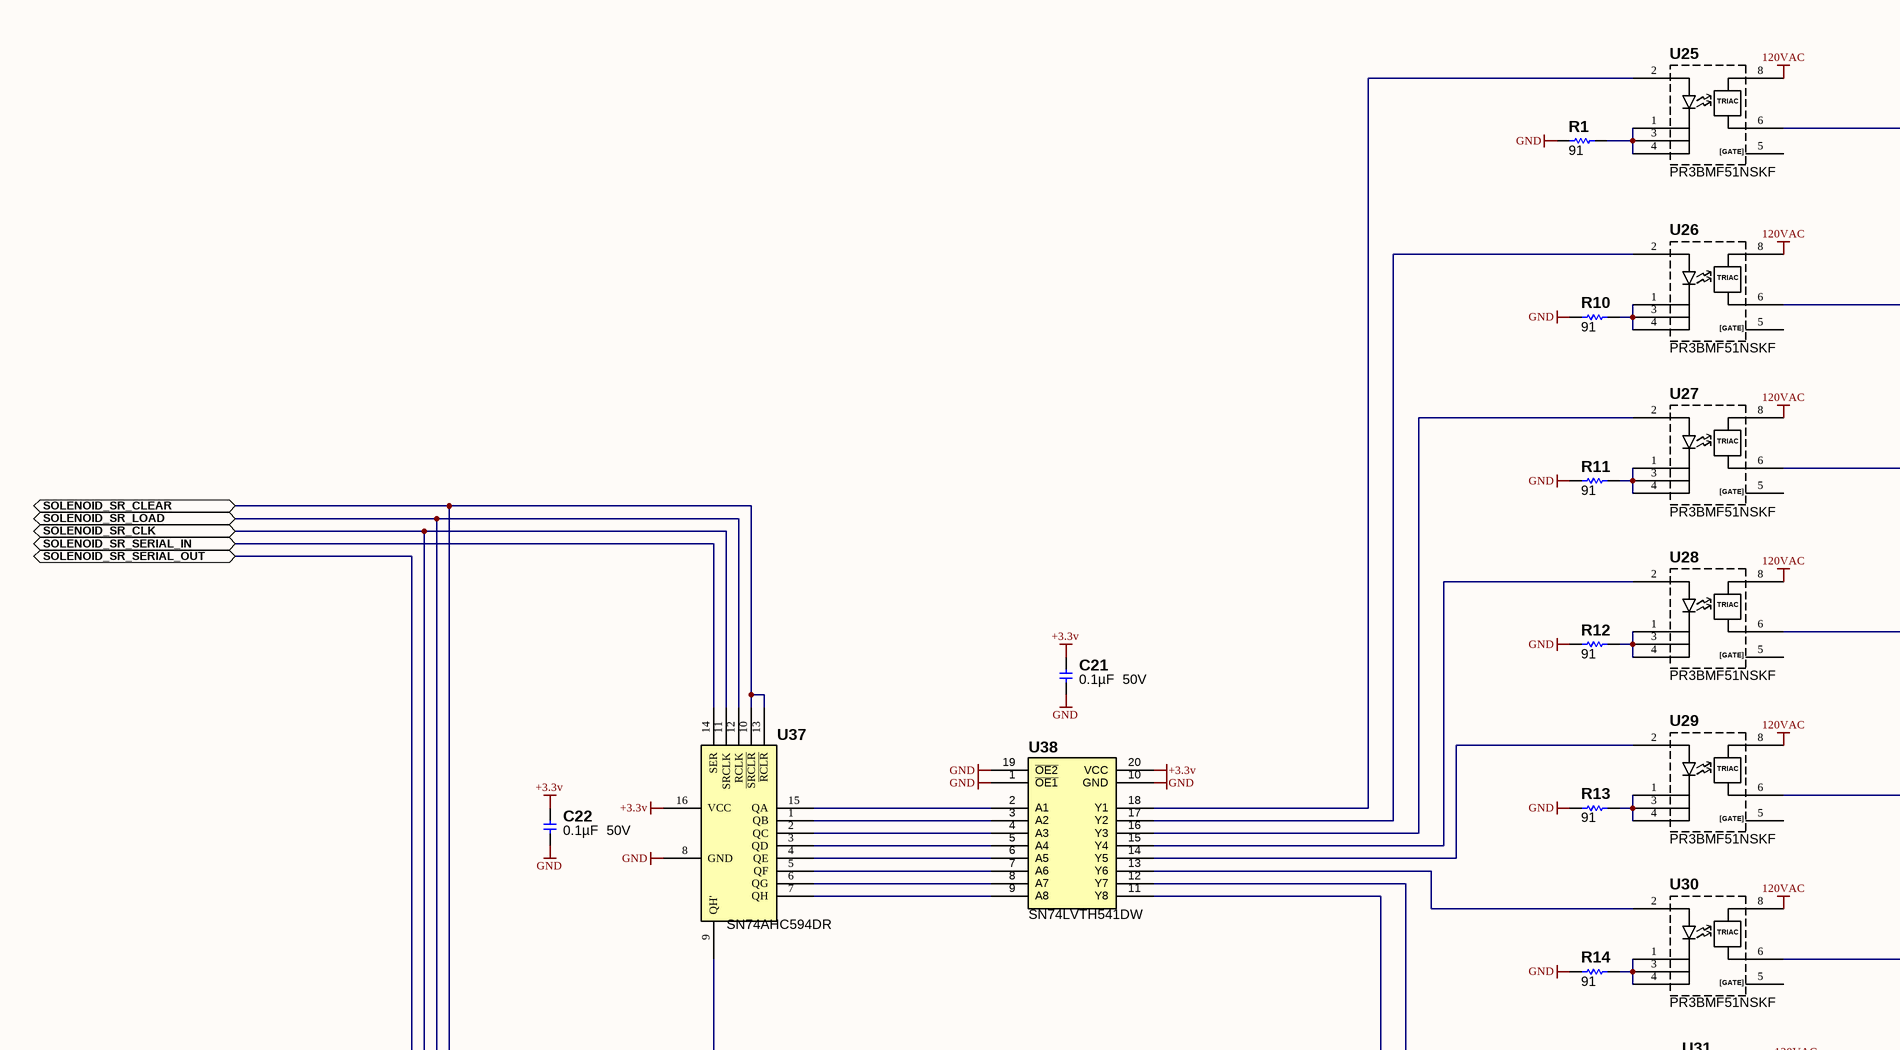
[diagram p8: SOLENOID-SSR.SchDoc, top left]
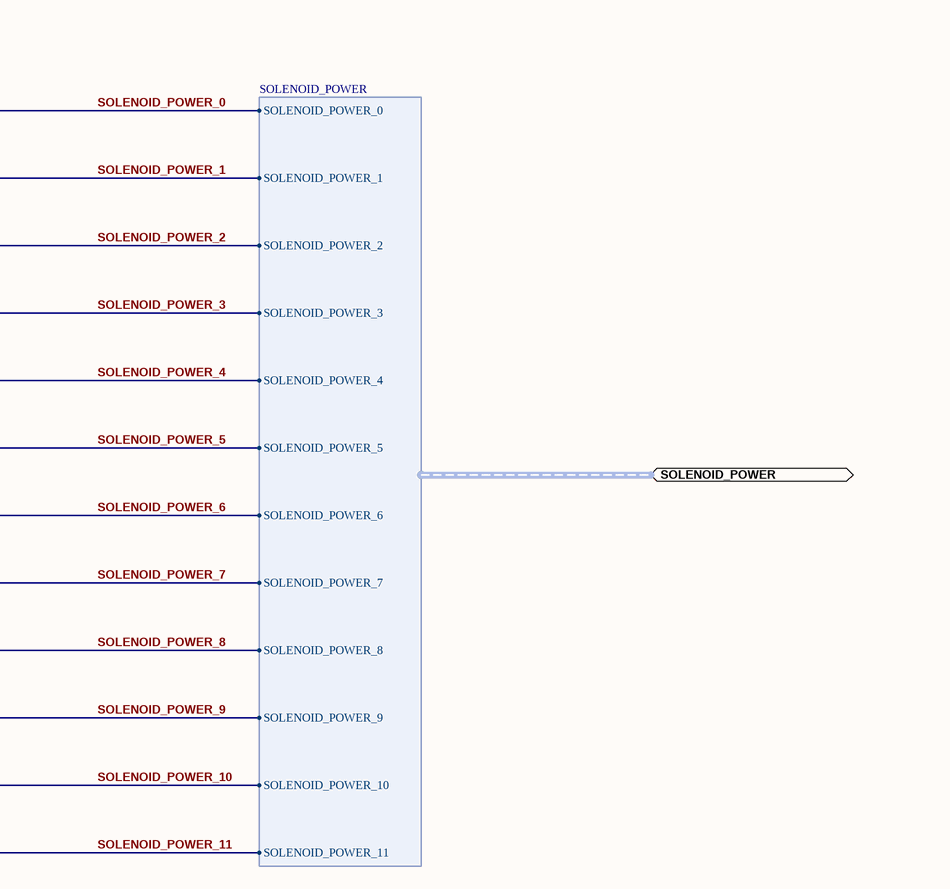
[diagram p9: SOLENOID-SSR.SchDoc, top right]
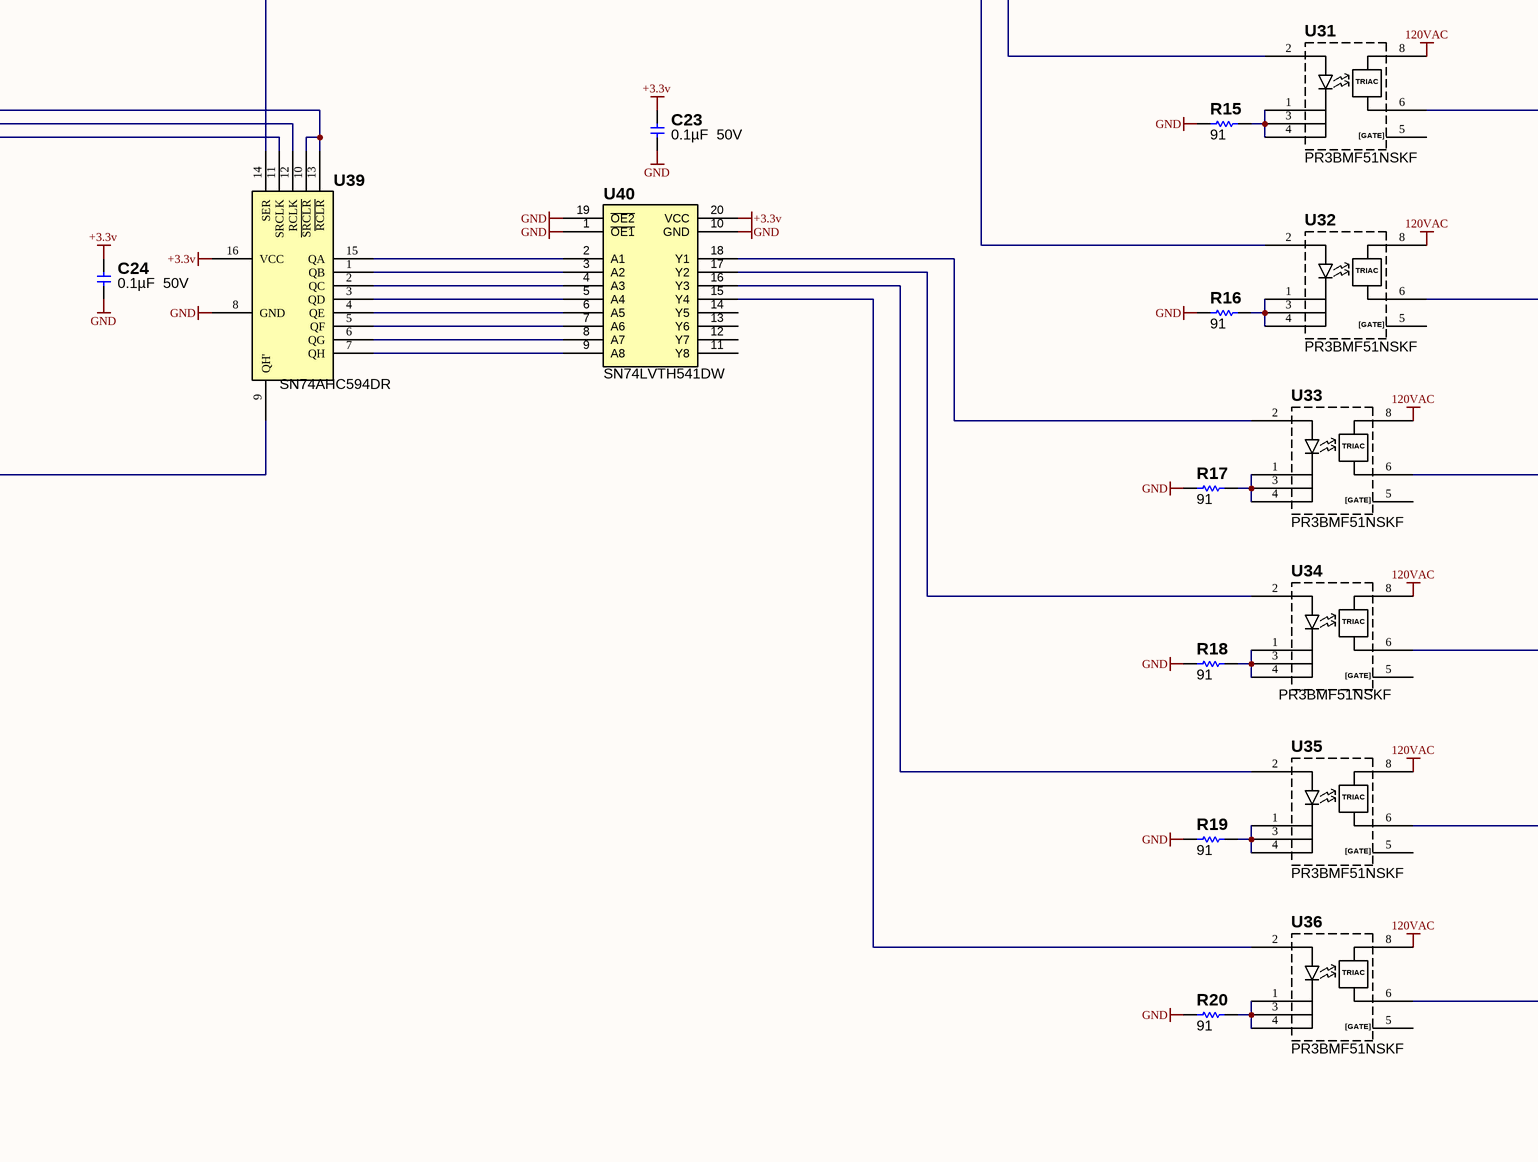
[diagram p10: SOLENOID-SSR.SchDoc, bottom left]
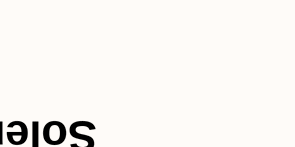
[diagram p11: SOLENOID-SSR.SchDoc, bottom right]

### Parts
C21  0.1µF  50V  [C0805_LD]
C22  0.1µF  50V  [C0805_LD]
C23  0.1µF  50V  [C0805_LD]
C24  0.1µF  50V  [C0805_LD]
R1  91  [R0805_LD]
R10  91  [R0805_LD]
R11  91  [R0805_LD]
R12  91  [R0805_LD]
R13  91  [R0805_LD]
R14  91  [R0805_LD]
R15  91  [R0805_LD]
R16  91  [R0805_LD]
R17  91  [R0805_LD]
R18  91  [R0805_LD]
R19  91  [R0805_LD]
R20  91  [R0805_LD]
U25  PR3BMF51NSKF  [DIP8_NO_PIN7]
U26  PR3BMF51NSKF  [DIP8_NO_PIN7]
U27  PR3BMF51NSKF  [DIP8_NO_PIN7]
U28  PR3BMF51NSKF  [DIP8_NO_PIN7]
U29  PR3BMF51NSKF  [DIP8_NO_PIN7]
U30  PR3BMF51NSKF  [DIP8_NO_PIN7]
U31  PR3BMF51NSKF  [DIP8_NO_PIN7]
U32  PR3BMF51NSKF  [DIP8_NO_PIN7]
U33  PR3BMF51NSKF  [DIP8_NO_PIN7]
U34  PR3BMF51NSKF  [DIP8_NO_PIN7]
U35  PR3BMF51NSKF  [DIP8_NO_PIN7]
U36  PR3BMF51NSKF  [DIP8_NO_PIN7]
U37  SN74AHC594DR  [SOIC127P600X145-16L]
U38  SN74LVTH541DW  [SOIC127P1030X265-20L]
U39  SN74AHC594DR  [SOIC127P600X145-16L]
U40  SN74LVTH541DW  [SOIC127P1030X265-20L]

### Ports
SOLENOID_POWER (harness SOLENOID_POWER), SOLENOID_SR_CLEAR, SOLENOID_SR_CLK, SOLENOID_SR_LOAD, SOLENOID_SR_SERIAL_IN, SOLENOID_SR_SERIAL_OUT

### Harnesses
SOLENOID_POWER: SOLENOID_POWER_0, SOLENOID_POWER_1, SOLENOID_POWER_2, SOLENOID_POWER_3, SOLENOID_POWER_4, SOLENOID_POWER_5, SOLENOID_POWER_6, SOLENOID_POWER_7, SOLENOID_POWER_8, SOLENOID_POWER_9, SOLENOID_POWER_10, SOLENOID_POWER_11

### Nets
120VAC: U25.8 U26.8 U27.8 U28.8 U29.8 U30.8 U31.8 U32.8 U33.8 U34.8 U35.8 U36.8
+3.3v: C21.2 C22.2 C23.2 C24.2 U37.16(VCC) U38.20(VCC) U39.16(VCC) U40.20(VCC)
GND: C21.1 C22.1 C23.1 C24.1 R1.1 R10.1 R11.1 R12.1 R13.1 R14.1 R15.1 R16.1 R17.1 R18.1 R19.1 R20.1 U37.8(GND) U38.1(~{OE1}) U38.10(GND) U38.19(~{OE2}) U39.8(GND) U40.1(~{OE1}) U40.10(GND) U40.19(~{OE2})
LCD_SCK: U37.11(SRCLK) U39.11(SRCLK) ; port SOLENOID_SR_CLK
MCU_SR_CLEAR: U37.10(~{SRCLR}) U37.13(~{RCLR}) U39.10(~{SRCLR}) U39.13(~{RCLR}) ; port SOLENOID_SR_CLEAR
MCU_SR_LOAD: U37.12(RCLK) U39.12(RCLK) ; port SOLENOID_SR_LOAD
SOLENOID_POWER_0: U25.6 ; port SOLENOID_POWER.SOLENOID_POWER_0
SOLENOID_POWER_1: U26.6 ; port SOLENOID_POWER.SOLENOID_POWER_1
SOLENOID_POWER_2: U27.6 ; port SOLENOID_POWER.SOLENOID_POWER_2
SOLENOID_POWER_3: U28.6 ; port SOLENOID_POWER.SOLENOID_POWER_3
SOLENOID_POWER_4: U29.6 ; port SOLENOID_POWER.SOLENOID_POWER_4
SOLENOID_POWER_5: U30.6 ; port SOLENOID_POWER.SOLENOID_POWER_5
SOLENOID_POWER_6: U31.6 ; port SOLENOID_POWER.SOLENOID_POWER_6
SOLENOID_POWER_7: U32.6 ; port SOLENOID_POWER.SOLENOID_POWER_7
SOLENOID_POWER_8: U33.6 ; port SOLENOID_POWER.SOLENOID_POWER_8
SOLENOID_POWER_9: U34.6 ; port SOLENOID_POWER.SOLENOID_POWER_9
SOLENOID_POWER_10: U35.6 ; port SOLENOID_POWER.SOLENOID_POWER_10
SOLENOID_POWER_11: U36.6 ; port SOLENOID_POWER.SOLENOID_POWER_11
NetR1_2: R1.2 U25.1 U25.3 U25.4
NetR10_2: R10.2 U26.1 U26.3 U26.4
NetR11_2: R11.2 U27.1 U27.3 U27.4
NetR12_2: R12.2 U28.1 U28.3 U28.4
NetR13_2: R13.2 U29.1 U29.3 U29.4
NetR14_2: R14.2 U30.1 U30.3 U30.4
NetR15_2: R15.2 U31.1 U31.3 U31.4
NetR16_2: R16.2 U32.1 U32.3 U32.4
NetR17_2: R17.2 U33.1 U33.3 U33.4
NetR18_2: R18.2 U34.1 U34.3 U34.4
NetR19_2: R19.2 U35.1 U35.3 U35.4
NetR20_2: R20.2 U36.1 U36.3 U36.4
NetU25_2: U25.2 U38.18(Y1)
NetU26_2: U26.2 U38.17(Y2)
NetU27_2: U27.2 U38.16(Y3)
NetU28_2: U28.2 U38.15(Y4)
NetU29_2: U29.2 U38.14(Y5)
NetU30_2: U30.2 U38.13(Y6)
NetU31_2: U31.2 U38.12(Y7)
NetU32_2: U32.2 U38.11(Y8)
NetU33_2: U33.2 U40.18(Y1)
NetU34_2: U34.2 U40.17(Y2)
NetU35_2: U35.2 U40.16(Y3)
NetU36_2: U36.2 U40.15(Y4)
NetU37_1: U37.1(QB) U38.3(A2)
NetU37_2: U37.2(QC) U38.4(A3)
NetU37_3: U37.3(QD) U38.5(A4)
NetU37_4: U37.4(QE) U38.6(A5)
NetU37_5: U37.5(QF) U38.7(A6)
NetU37_6: U37.6(QG) U38.8(A7)
NetU37_7: U37.7(QH) U38.9(A8)
NetU37_9: U37.9(QH') U39.14(SER)
NetU37_14: U37.14(SER) ; port SOLENOID_SR_SERIAL_IN
NetU37_15: U37.15(QA) U38.2(A1)
NetU39_1: U39.1(QB) U40.3(A2)
NetU39_2: U39.2(QC) U40.4(A3)
NetU39_3: U39.3(QD) U40.5(A4)
NetU39_4: U39.4(QE) U40.6(A5)
NetU39_5: U39.5(QF) U40.7(A6)
NetU39_6: U39.6(QG) U40.8(A7)
NetU39_7: U39.7(QH) U40.9(A8)
NetU39_9: U39.9(QH') ; port SOLENOID_SR_SERIAL_OUT
NetU39_15: U39.15(QA) U40.2(A1)

Not connected (* = marked no-connect by the designer): U25 5; U26 5; U27 5; U28 5; U29 5; U30 5; U31 5; U32 5; U33 5; U34 5; U35 5; U36 5; U40 11(Y8) 12(Y7) 13(Y6) 14(Y5)

### Notes on the sheet
- Solenoid Relays
- -1
- Wavenumber LLC
- 2pl
- Rev:
- Sheet
- of
- (in symbol PR3BMF51NSKF) TRIAC; [GATE]

### Library data of the parts
C21-C24 = GRM21BR71H104KA01L: as C19 on sheet HEATER-SSR; Value: 0.1µF  50V; Temperature Coefficient: X7R; Manufacturer Part Number: GRM21BR71H104KA01L; ComponentLink1Description: \\altium.sil.arl.psu.edu\Libraries\datasheets\Murata Electronics North America\c02e.pdf; ComponentLink1URL: http://search.murata.co.jp/Ceramy/image/img/A01X/G101/ENG/GRM1555C1HR60WA01-01.pdf; ComponentLink2Description: External Datasheet; ComponentLink2URL: http://www.murata.com/products/catalog/pdf/c02e.pdf; Stocked: 0; Supplier 1: Digi-Key; Supplier Part Number 1: 490-1666-1-ND; Category: Capacitors; Sort Value: 100000; Sort Value Package: 0805_100000; Pricing: 1 = 0.1  ;  10 = 0.046  ;  50 = 0.0248  ;  100 = 0.0209  ;  250 = 0.01712  ;  500 = 0.01464  ;  1000 = 0.0114 (USD); Sales Status: Active; Capacitance: 0.1µF; Voltage - Rated: 50V; Tolerance: ±10%; Mounting Type: Surface Mount- MLCC; Operating Temperature: -55°C ~ 125°C; Applications: General Purpose; Ratings: -; Package / Case: 0805 (2012 Metric); Size / Dimension: 0.079" L x 0.049" W (2.00mm x 1.25mm); Height - Seated (Max): -; Thickness (Max): 0.053" (1.35mm); Lead Spacing: -; Features: -; Packaging: Cut Tape (CT); Lead Style: -; Package: 0805; Thickness: 135
R1 R10-R20 = ERJ-6ENF91R0V: as R2 on sheet HEATER-SSR; Value: 91; Manufacturer Part Number: ERJ-6ENF91R0V; ComponentLink1Description: Internal Datasheet; ComponentLink1URL: \\altium.sil.arl.psu.edu\Libraries\datasheets\Panasonic Electronic Components\AOA0000CE2.pdf; ComponentLink2Description: External Datasheet; ComponentLink2URL: http://industrial.panasonic.com/www-data/pdf/AOA0000/AOA0000CE2.pdf; Stocked: 0; Supplier 1: Digi-Key; Supplier Part Number 1: P91.0CCT-ND; Category: Resistors; Resistance (Ohms): 91; Composition: Thick Film; Features: -; Tolerance: ±1%; Package / Case: 0805 (2012 Metric); Footprint: 805; Size / Dimension: 0.079" L x 0.049" W (2.00mm x 1.25mm); Height: 0.028" (0.70mm); Number of Terminations: 2; Packaging: Cut Tape (CT); Sort Value: 91; Sort Value Package: 805_91
U25-U36 = PR3BMF51NSKF: RELAY SSR 10MA 240V 1.2A 8-DIP; Manufacturer: Sharp Microelectronics; Circuit: SPST-NO (1 Form A); Output Type: AC; Voltage - Input: 1.2VDC; Voltage - Load: 0 ~ 240 V; Supplier 1: Digi-Key; Supplier Part Number 1: 425-2562-5-ND; Manufacturer Part Number: PR3BMF51NSKF; RoHS: RoHS Compliant; Category: Relays; Stock 1: 973; Pricing 1: 1=1.38, 10=1.1, 25=1.0452, 100=0.9075, 500=0.7975, 750=0.75351, 1000=0.715, 2500=0.6875, 5000=0.671 (USD); Mounting Type: Through Hole; ComponentLink1URL: http://www.sharpsma.com/webfm_send/1389; ComponentLink1Description: http://www.sharpsma.com/webfm_send/1389; Value: PR3BMF51NSKF; Packaging: Tube; On-State Resistance: -; Load Current: 1.2A; Termination Style: PC Pin; Package / Case: 8-DIP (0.300", 7.62mm), 7 Leads; Supplier Device Package: 8-DIP; Relay Type: Relay
U37 U39 = SN74AHC594DR: as U53 on sheet HEATER-SSR; Supplier 1: Digi-Key; Manufacturer Part Number: SN74AHC594DR; RoHS: RoHS Compliant; Category: Integrated Circuits (ICs); Stock 1: 1808; Pricing 1: 1=0.59, 10=0.494, 25=0.4332, 100=0.3708, 250=0.3216, 500=0.2724, 1000=0.21 (USD); Packaging: Cut Tape (CT); Logic Type: Shift Register; Operating Temperature: -40°C ~ 85°C; Mounting Type: Surface Mount; Package / Case: 16-SOIC (0.154", 3.90mm Width); Supplier Device Package: 16-SOIC N; ComponentLink1URL: http://www.ti.com/lit/ds/symlink/sn74ahc594.pdf; ComponentLink1Description: http://www.ti.com/lit/ds/symlink/sn74ahc594.pdf; Supplier Part Number 1: 296-31743-1-ND; Value: SN74AHC594DR
U38 U40 = SN74LVTH541DW: as U67 on sheet HEATER-SSR; Value: SN74LVTH541DW; Supplier 1: Digi-Key; Supplier Part Number 1: 296-8728-5-ND; Manufacturer Part Number: SN74LVTH541DW; RoHS: RoHS Compliant; Category: Integrated Circuits (ICs); Stock 1: 8053; Pricing 1: 1=2.02, 25=1.6252, 100=1.4625, 250=1.3, 500=1.1375, 1000=0.9425, 2500=0.8775, 5000=0.845, 10000=0.8125 (USD); Packaging: Tube; Operating Temperature: -40°C ~ 85°C; Mounting Type: Surface Mount; Package / Case: 20-SOIC (0.295", 7.50mm Width); Supplier Device Package: 20-SOIC; ComponentLink1URL: http://www.ti.com/lit/ds/symlink/sn74lvth541.pdf; ComponentLink1Description: http://www.ti.com/lit/ds/symlink/sn74lvth541.pdf